# EAGLE schematic Nava_v1.02 (EAGLE 6.1), part 1 of 2

## Sheet 1 of 15: SEQ
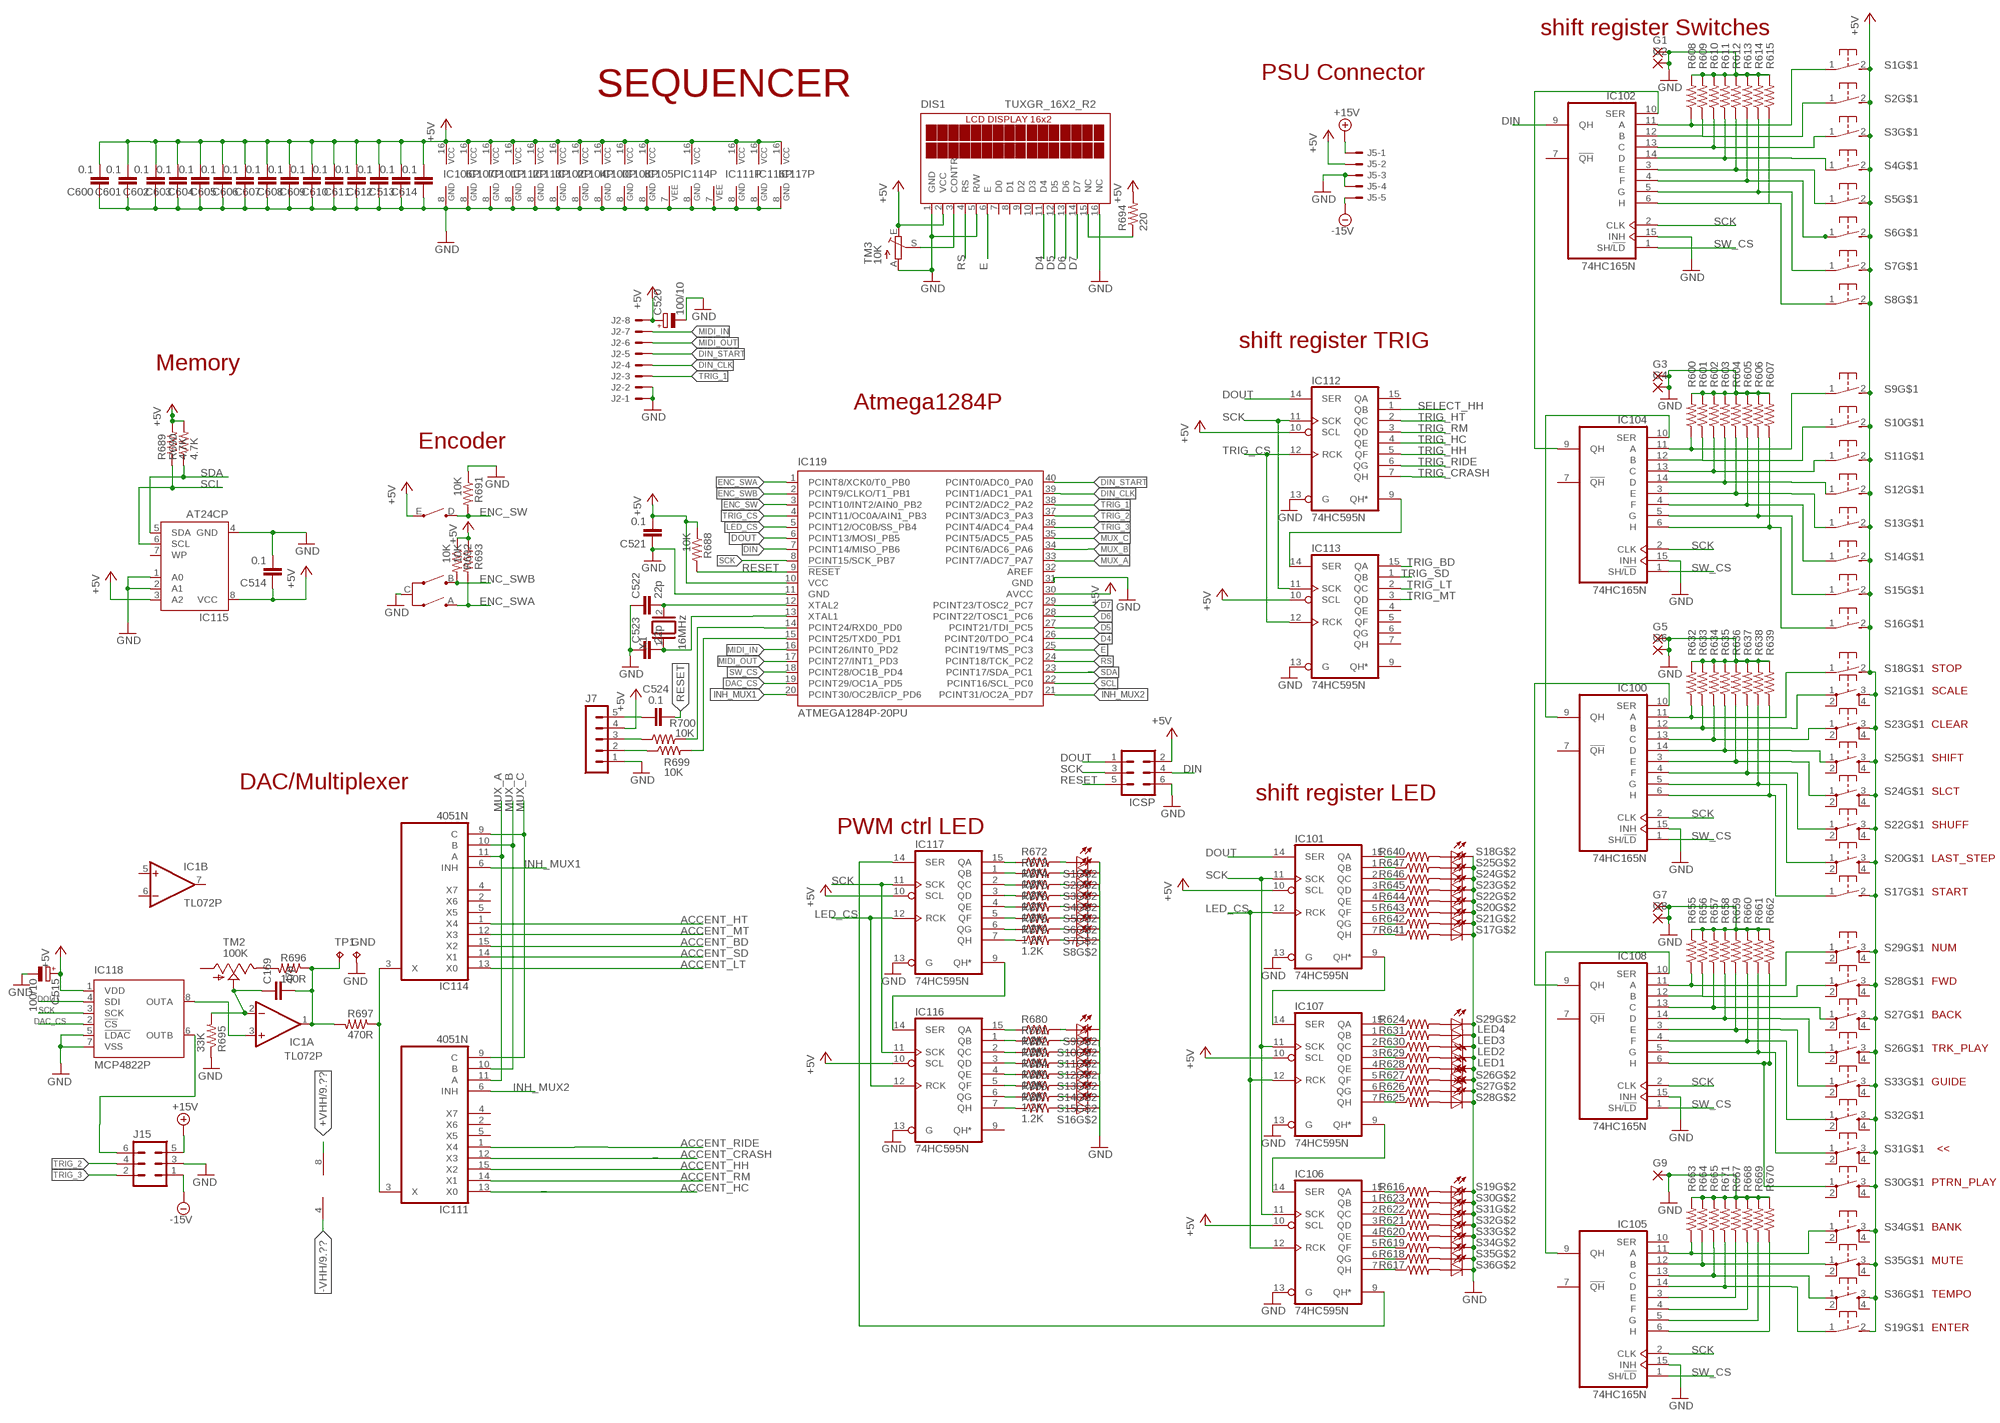
[diagram p0: schematic, sheet 1]

### Parts
C169  47p  C-EU025-025X050  [C025-025X050]
C513  0.1  C-EU050-024X044  [C050-024X044]
C514  0.1  C-EU050-024X044  [C050-024X044]
C515  100/10  CPOL-EUE2-5  [E2-5]
C520  100/10  CPOL-EUE2-5  [E2-5]
C521  0.1  C-EU050-024X044  [C050-024X044]
C522  22p  C-EU025-025X050  [C025-025X050]
C523  22p  C-EU025-025X050  [C025-025X050]
C524  0.1  C-EU050-024X044  [C050-024X044]
C600  0.1  C-EU050-024X044  [C050-024X044]
C601  0.1  C-EU050-024X044  [C050-024X044]
C602  0.1  C-EU050-024X044  [C050-024X044]
C603  0.1  C-EU050-024X044  [C050-024X044]
C604  0.1  C-EU050-024X044  [C050-024X044]
C605  0.1  C-EU050-024X044  [C050-024X044]
C606  0.1  C-EU050-024X044  [C050-024X044]
C607  0.1  C-EU050-024X044  [C050-024X044]
C608  0.1  C-EU050-024X044  [C050-024X044]
C609  0.1  C-EU050-024X044  [C050-024X044]
C610  0.1  C-EU050-024X044  [C050-024X044]
C611  0.1  C-EU050-024X044  [C050-024X044]
C612  0.1  C-EU050-024X044  [C050-024X044]
C614  0.1  C-EU050-024X044  [C050-024X044]
DIS1  TUXGR_16X2_R2  [TUXGR_16X2_R2]
G1  WIREPAD1,6/0,8  [1,6/0,8]
G2  WIREPAD1,6/0,8  [1,6/0,8]
G3  WIREPAD1,6/0,8  [1,6/0,8]
G4  WIREPAD1,6/0,8  [1,6/0,8]
G5  WIREPAD1,6/0,8  [1,6/0,8]
G6  WIREPAD1,6/0,8  [1,6/0,8]
G7  WIREPAD1,6/0,8  [1,6/0,8]
G8  WIREPAD1,6/0,8  [1,6/0,8]
G9  WIREPAD1,6/0,8  [1,6/0,8]
GND  TPPAD1-13  [P1-13]
IC1  TL072P  [DIL08]
IC100  74HC165N  [DIL16]
IC101  74HC595N  [DIL16]
IC102  74HC165N  [DIL16]
IC104  74HC165N  [DIL16]
IC105  74HC165N  [DIL16]
IC106  74HC595N  [DIL16]
IC107  74HC595N  [DIL16]
IC108  74HC165N  [DIL16]
IC111  4051N  [DIL16]
IC112  74HC595N  [DIL16]
IC113  74HC595N  [DIL16]
IC114  4051N  [DIL16]
IC115  AT24CP  [DIL08]
IC116  74HC595N  [DIL16]
IC117  74HC595N  [DIL16]
IC118  MCP4822P  [DIL8]
IC119  ATMEGA1284P-20PU  ATMEGA644-20PUDIP  [DIL40]
ICSP  MA03-2  [MA03-2]
J2  22-27-2081-08  [6410-08]
J5  KK-156-5  [KK-156-5]
J7  MA05-1  [MA05-1A]
J15  MA03-2  [MA03-2]
LED1  LED3MM  [LED3MM]
LED2  LED3MM  [LED3MM]
LED3  LED3MM  [LED3MM]
LED4  LED3MM  [LED3MM]
R600  10K  R-US_0207/7  [0207/7]
R601  10K  R-US_0207/7  [0207/7]
R602  10K  R-US_0207/7  [0207/7]
R603  10K  R-US_0207/7  [0207/7]
R604  10K  R-US_0207/7  [0207/7]
R605  10K  R-US_0207/7  [0207/7]
R606  10K  R-US_0207/7  [0207/7]
R607  10K  R-US_0207/7  [0207/7]
R608  10K  R-US_0207/7  [0207/7]
R609  10K  R-US_0207/7  [0207/7]
R610  10K  R-US_0207/7  [0207/7]
R611  10K  R-US_0207/7  [0207/7]
R612  10K  R-US_0207/7  [0207/7]
R613  10K  R-US_0207/7  [0207/7]
R614  10K  R-US_0207/7  [0207/7]
R615  10K  R-US_0207/7  [0207/7]
R616  1.2K  R-US_0207/7  [0207/7]
R617  1.2K  R-US_0207/7  [0207/7]
R618  1.2K  R-US_0207/7  [0207/7]
R619  1.2K  R-US_0207/7  [0207/7]
R620  1.2K  R-US_0207/7  [0207/7]
R621  1.2K  R-US_0207/7  [0207/7]
R622  1.2K  R-US_0207/7  [0207/7]
R623  1.2K  R-US_0207/7  [0207/7]
R624  1.2K  R-US_0207/7  [0207/7]
R625  1.2K  R-US_0207/7  [0207/7]
R626  1.2K  R-US_0207/7  [0207/7]
R627  1.2K  R-US_0207/7  [0207/7]
R628  1.2K  R-US_0207/7  [0207/7]
R629  1.2K  R-US_0207/7  [0207/7]
R630  1.2K  R-US_0207/7  [0207/7]
R631  1.2K  R-US_0207/7  [0207/7]
R632  10K  R-US_0207/7  [0207/7]
R633  10K  R-US_0207/7  [0207/7]
R634  10K  R-US_0207/7  [0207/7]
R635  10K  R-US_0207/7  [0207/7]
R636  10K  R-US_0207/7  [0207/7]
R637  10K  R-US_0207/7  [0207/7]
R638  10K  R-US_0207/7  [0207/7]
R639  10K  R-US_0207/7  [0207/7]
R640  1.2K  R-US_0207/7  [0207/7]
R641  1.2K  R-US_0207/7  [0207/7]
R642  1.2K  R-US_0207/7  [0207/7]
R643  1.2K  R-US_0207/7  [0207/7]
R644  1.2K  R-US_0207/7  [0207/7]
R645  1.2K  R-US_0207/7  [0207/7]
R646  1.2K  R-US_0207/7  [0207/7]
R647  1.2K  R-US_0207/7  [0207/7]
R655  10K  R-US_0207/7  [0207/7]
R656  10K  R-US_0207/7  [0207/7]
R657  10K  R-US_0207/7  [0207/7]
R658  10K  R-US_0207/7  [0207/7]
R659  10K  R-US_0207/7  [0207/7]
R660  10K  R-US_0207/7  [0207/7]
R661  10K  R-US_0207/7  [0207/7]
R662  10K  R-US_0207/7  [0207/7]
R663  10K  R-US_0207/7  [0207/7]
R664  10K  R-US_0207/7  [0207/7]
R665  10K  R-US_0207/7  [0207/7]
R667  10K  R-US_0207/7  [0207/7]
R668  10K  R-US_0207/7  [0207/7]
R669  10K  R-US_0207/7  [0207/7]
R670  10K  R-US_0207/7  [0207/7]
R671  10K  R-US_0207/7  [0207/7]
R672  1.2K  R-US_0207/7  [0207/7]
R673  1.2K  R-US_0207/7  [0207/7]
R674  1.2K  R-US_0207/7  [0207/7]
R675  1.2K  R-US_0207/7  [0207/7]
R676  1.2K  R-US_0207/7  [0207/7]
R677  1.2K  R-US_0207/7  [0207/7]
R678  1.2K  R-US_0207/7  [0207/7]
R679  1.2K  R-US_0207/7  [0207/7]
R680  1.2K  R-US_0207/7  [0207/7]
R681  1.2K  R-US_0207/7  [0207/7]
R682  1.2K  R-US_0207/7  [0207/7]
R683  1.2K  R-US_0207/7  [0207/7]
R684  1.2K  R-US_0207/7  [0207/7]
R685  1.2K  R-US_0207/7  [0207/7]
R686  1.2K  R-US_0207/7  [0207/7]
R687  1.2K  R-US_0207/7  [0207/7]
R688  10K  R-US_0207/7  [0207/7]
R689  4.7K  R-US_0207/7  [0207/7]
R690  4.7K  R-US_0207/7  [0207/7]
R691  10K  R-US_0207/7  [0207/7]
R692  10K  R-US_0207/7  [0207/7]
R693  10K  R-US_0207/7  [0207/7]
R694  220  R-US_0207/7  [0207/7]
R695  33K  R-US_0207/7  [0207/7]
R696  100R  R-US_0207/7  [0207/7]
R697  470R  R-US_0207/7  [0207/7]
R699  10K  R-US_0207/7  [0207/7]
R700  10K  R-US_0207/7  [0207/7]
S1  MX1A_CHERRY_SW_LED"  [MX1A-SW]
S2  MX1A_CHERRY_SW_LED"  [MX1A-SW]
S3  MX1A_CHERRY_SW_LED"  [MX1A-SW]
S4  MX1A_CHERRY_SW_LED"  [MX1A-SW]
S5  MX1A_CHERRY_SW_LED"  [MX1A-SW]
S6  MX1A_CHERRY_SW_LED"  [MX1A-SW]
S7  MX1A_CHERRY_SW_LED"  [MX1A-SW]
S8  MX1A_CHERRY_SW_LED"  [MX1A-SW]
S9  MX1A_CHERRY_SW_LED"  [MX1A-SW]
S10  MX1A_CHERRY_SW_LED"  [MX1A-SW]
S11  MX1A_CHERRY_SW_LED"  [MX1A-SW]
S12  MX1A_CHERRY_SW_LED"  [MX1A-SW]
S13  MX1A_CHERRY_SW_LED"  [MX1A-SW]
S14  MX1A_CHERRY_SW_LED"  [MX1A-SW]
S15  MX1A_CHERRY_SW_LED"  [MX1A-SW]
S16  MX1A_CHERRY_SW_LED"  [MX1A-SW]
S17  MX1A_CHERRY_SW_LED"  [MX1A-SW]
S18  MX1A_CHERRY_SW_LED"  [MX1A-SW]
S19  MX1A_CHERRY_SW_LED"  [MX1A-SW]
S20  ZTSN_SW_LED"  [SPH_SW]
S21  ZTSN_SW_LED"  [SPH_SW]
S22  ZTSN_SW_LED"  [SPH_SW]
S23  ZTSN_SW_LED"  [SPH_SW]
S24  ZTSN_SW_LED"  [SPH_SW]
S25  ZTSN_SW_LED"  [SPH_SW]
S26  ZTSN_SW_LED"  [SPH_SW]
S27  ZTSN_SW_LED"  [SPH_SW]
S28  ZTSN_SW_LED"  [SPH_SW]
S29  ZTSN_SW_LED"  [SPH_SW]
S30  ZTSN_SW_LED"  [SPH_SW]
S31  ZTSN_SW_LED"  [SPH_SW]
S32  ZTSN_SW_LED"  [SPH_SW]
S33  ZTSN_SW_LED"  [SPH_SW]
S34  ZTSN_SW_LED"  [SPH_SW]
S35  ZTSN_SW_LED"  [SPH_SW]
S36  ZTSN_SW_LED"  [SPH_SW]
TM2  100K  TRIM_US-S64W  [S64W]
TM3  10K  TRIM_EU-B25P  [B25P]
TP1  TPPAD1-13  [P1-13]
VR29  PEC16_ENCODER  [PEC16_ENCODER]
X1  16MHz  XTAL/S  [QS]

### Nets
+5V: C513.2 C514.1 C515.+ C520.+ C521.2 C600.2 C601.2 C602.2 C603.2 C604.2 C605.2 C606.2 C607.2 C608.2 C609.2 C610.2 C611.2 C612.2 C614.2 DIS1.2(VCC) IC100.16(VCC) IC101.10(SCL) IC101.16(VCC) IC102.16(VCC) IC104.16(VCC) IC105.16(VCC) IC106.10(SCL) IC106.16(VCC) IC107.10(SCL) IC107.16(VCC) IC108.16(VCC) IC111.16(VCC) IC112.10(SCL) IC112.16(VCC) IC113.10(SCL) IC113.16(VCC) IC114.16(VCC) IC115.3(A2) IC115.8(VCC) IC116.10(SCL) IC116.16(VCC) IC117.10(SCL) IC117.16(VCC) IC118.1(VDD) IC119.10(VCC) IC119.30(AVCC) ICSP.2 J2.8 J5.2 J7.4 R688.1 R689.2 R690.2 R692.1 R693.1 R694.2 S1.2(S) S2.2(S) S3.2(S) S4.2(S) S5.2(S) S6.2(S) S7.2(S) S8.2(S) S9.2(S) S10.2(S) S11.2(S) S12.2(S) S13.2(S) S14.2(S) S15.2(S) S16.2(S) S17.2(S) S18.2(S) S19.2(S) S20.3(S) S22.3(S) S23.3(S) S24.3(S) S25.3(S) S26.3(S) S27.3(S) S28.3(S) S29.3(S) S30.3(S) S31.3(S) S32.3(S) S33.3(S) S34.3(S) S35.3(S) S36.3(S) TM3.E VR29.E ; also sheet 9,10,11,14,15
+15V: J5.1 J15.5 ; also sheet 2,3,4,6,7,8,9,11,12,13
+VHH: IC1.8(P:V+) ; also sheet 9
-15V: J5.5 J15.1 ; also sheet 2,3,4,6,7,8,9,11,12,13
-VHH: IC1.4(P:V-) ; also sheet 9
ACCENT_BD: IC114.15(X2) ; also sheet 2
ACCENT_CRASH: IC111.12(X3) ; also sheet 10
ACCENT_HC: IC111.13(X0) ; also sheet 8
ACCENT_HH: IC111.15(X2) ; also sheet 9
ACCENT_HT: IC114.1(X4) ; also sheet 6
ACCENT_LT: IC114.13(X0) ; also sheet 4
ACCENT_MT: IC114.12(X3) ; also sheet 5
ACCENT_RIDE: IC111.1(X4) ; also sheet 11
ACCENT_RM: IC111.14(X1) ; also sheet 7
ACCENT_SD: IC114.14(X1) ; also sheet 3
D4 [special]: DIS1.11(D4) IC119.26(PCINT20/TDO_PC4)
D5 [special]: DIS1.12(D5) IC119.27(PCINT21/TDI_PC5)
D6 [special]: DIS1.13(D6) IC119.28(PCINT22/TOSC1_PC6)
D7 [special]: DIS1.14(D7) IC119.29(PCINT23/TOSC2_PC7)
DAC_CS [special]: IC118.2(!CS!) IC119.19(PCINT29/OC1A_PD5)
DIN [special]: IC102.9(QH) IC119.7(PCINT14/MISO_PB6) ICSP.4
DIN_CLK [special]: IC119.39(PCINT1/ADC1_PA1) J2.4
DIN_START [special]: IC119.40(PCINT0/ADC0_PA0) J2.5
DOUT [special]: IC101.14(SER) IC112.14(SER) IC118.4(SDI) IC119.6(PCINT13/MOSI_PB5) ICSP.1
E [special]: DIS1.6(E) IC119.25(PCINT19/TMS_PC3)
ENC_SW [special]: IC119.3(PCINT10/INT2/AIN0_PB2) R691.2 VR29.D
ENC_SWA [special]: IC119.1(PCINT8/XCK0/T0_PB0) R693.2 VR29.A
ENC_SWB [special]: IC119.2(PCINT9/CLKO/T1_PB1) R692.2 VR29.B
GND: C513.1 C514.2 C515.- C520.- C521.1 C522.1 C523.1 C600.1 C601.1 C602.1 C603.1 C604.1 C605.1 C606.1 C607.1 C608.1 C609.1 C610.1 C611.1 C612.1 C614.1 DIS1.1(GND) DIS1.5(R/W) DIS1.16(NC) G1.1(P) G2.1(P) G3.1(P) G4.1(P) G5.1(P) G6.1(P) G7.1(P) G8.1(P) G9.1(P) GND.TP IC100.8(GND) IC100.15(INH) IC101.8(GND) IC101.13(G) IC102.8(GND) IC102.15(INH) IC104.8(GND) IC104.15(INH) IC105.8(GND) IC105.15(INH) IC106.8(GND) IC106.13(G) IC107.8(GND) IC107.13(G) IC108.8(GND) IC108.15(INH) IC111.7(VEE) IC111.8(GND) IC112.8(GND) IC112.13(G) IC113.8(GND) IC113.13(G) IC114.7(VEE) IC114.8(GND) IC115.1(A0) IC115.2(A1) IC115.4(GND) IC116.8(GND) IC116.13(G) IC117.8(GND) IC117.13(G) IC118.5(!LDAC!) IC118.7(VSS) IC119.11(GND) IC119.31(GND) ICSP.6 J2.1 J2.2 J5.3 J5.4 J7.1 J15.3 LED1.K(C) LED2.K(C) LED3.K(C) LED4.K(C) R600.2 R601.2 R602.2 R603.2 R604.2 R605.2 R606.2 R607.2 R608.2 R609.2 R610.2 R611.2 R612.2 R613.2 R614.2 R615.2 R632.2 R633.2 R634.2 R635.2 R636.2 R637.2 R638.2 R639.2 R655.2 R656.2 R657.2 R658.2 R659.2 R660.2 R661.2 R662.2 R663.2 R664.2 R665.2 R667.2 R668.2 R669.2 R670.2 R671.2 R691.1 R695.1 S1.K(C) S2.K(C) S3.K(C) S4.K(C) S5.K(C) S6.K(C) S7.K(C) S8.K(C) S9.K(C) S10.K(C) S11.K(C) S12.K(C) S13.K(C) S14.K(C) S15.K(C) S16.K(C) S17.K(C) S18.K(C) S19.K(C) S20.K(C) S21.K(C) S22.K(C) S23.K(C) S24.K(C) S25.K(C) S26.K(C) S27.K(C) S28.K(C) S29.K(C) S30.K(C) S31.K(C) S32.K(C) S33.K(C) S34.K(C) S35.K(C) S36.K(C) TM3.A VR29.C ; also sheet 2,3,4,5,6,7,8,9,10,11,12,13,14,15
INH_MUX1 [special]: IC114.6(INH) IC119.20(PCINT30/OC2B/ICP_PD6)
INH_MUX2 [special]: IC111.6(INH) IC119.21(PCINT31/OC2A_PD7)
LED_CS [special]: IC101.12(RCK) IC106.12(RCK) IC107.12(RCK) IC116.12(RCK) IC117.12(RCK) IC119.5(PCINT12/OC0B/SS_PB4)
MIDI_IN [special]: IC119.16(PCINT26/INT0_PD2) J2.7
MIDI_OUT [special]: IC119.17(PCINT27/INT1_PD3) J2.6
MUX_A [special]: IC111.11(A) IC114.11(A) IC119.33(PCINT7/ADC7_PA7)
MUX_B [special]: IC111.10(B) IC114.10(B) IC119.34(PCINT6/ADC6_PA6)
MUX_C [special]: IC111.9(C) IC114.9(C) IC119.35(PCINT5/ADC5_PA5)
N$1 [special]: R624.2 S29.A
N$2 [special]: R625.2 S28.A
N$3 [special]: R626.2 S27.A
N$4 [special]: R627.2 S26.A
N$5 [special]: R647.2 S25.A
N$6 [special]: R646.2 S24.A
N$7 [special]: R645.2 S23.A
N$8 [special]: R644.2 S22.A
N$9 [special]: R642.2 S21.A
N$10 [special]: R643.2 S20.A
N$11 [special]: R640.2 S18.A
N$12 [special]: R641.2 S17.A
N$13 [special]: LED4.A R631.2
N$14 [special]: LED3.A R630.2
N$15 [special]: LED2.A R629.2
N$16 [special]: LED1.A R628.2
N$17 [special]: R616.2 S19.A
N$18 [special]: R617.2 S36.A
N$19 [special]: R618.2 S35.A
N$20 [special]: R619.2 S34.A
N$21 [special]: R620.2 S33.A
N$22 [special]: R621.2 S32.A
N$23 [special]: R622.2 S31.A
N$24 [special]: R623.2 S30.A
N$163 [special]: IC108.14(D) R658.1 S26.1(P)
N$164: IC1.3(A:+IN) IC118.8(OUTA)
N$166 [special]: IC117.15(QA) R672.1
N$222 [special]: IC117.1(QB) R673.1
N$231 [special]: IC117.2(QC) R674.1
N$233 [special]: IC117.3(QD) R675.1
N$236 [special]: IC117.4(QE) R676.1
N$237 [special]: IC117.5(QF) R677.1
N$238 [special]: IC117.6(QG) R678.1
N$239 [special]: IC117.7(QH) R679.1
N$241 [special]: IC116.14(SER) IC117.9(QH*)
N$242 [special]: IC116.15(QA) R680.1
N$243 [special]: IC116.1(QB) R681.1
N$244 [special]: IC116.2(QC) R682.1
N$245 [special]: IC116.3(QD) R683.1
N$246 [special]: IC116.4(QE) R684.1
N$247 [special]: IC116.5(QF) R685.1
N$248 [special]: IC116.6(QG) R686.1
N$249 [special]: IC116.7(QH) R687.1
N$250 [special]: R680.2 S9.A
N$251 [special]: R681.2 S10.A
N$252 [special]: R682.2 S11.A
N$253 [special]: R683.2 S12.A
N$254 [special]: R684.2 S13.A
N$255 [special]: R685.2 S14.A
N$256 [special]: R686.2 S15.A
N$257 [special]: R687.2 S16.A
N$258 [special]: R672.2 S1.A
N$259 [special]: R673.2 S2.A
N$260 [special]: R674.2 S3.A
N$261 [special]: R675.2 S4.A
N$262 [special]: R676.2 S5.A
N$263 [special]: R677.2 S6.A
N$264 [special]: R678.2 S7.A
N$265 [special]: R679.2 S8.A
N$266 [special]: IC106.9(QH*) IC117.14(SER)
N$268 [special]: IC118.6(OUTB) J15.6
N$272 [special]: IC119.15(PCINT25/TXD0_PD1) R699.2
N$273 [special]: IC119.14(PCINT24/RXD0_PD0) R700.2
N$377 [special]: C522.2 IC119.12(XTAL2) X1.2
N$378 [special]: C523.2 IC119.13(XTAL1) X1.1
N$587 [special]: IC102.11(A) R608.1 S1.1(P)
N$592 [special]: IC102.12(B) R609.1 S2.1(P)
N$593 [special]: IC102.13(C) R610.1 S3.1(P)
N$594 [special]: IC102.14(D) R611.1 S4.1(P)
N$595 [special]: IC102.3(E) R612.1 S5.1(P)
N$596 [special]: IC102.4(F) R613.1 S6.1(P)
N$597 [special]: IC102.5(G) R614.1 S7.1(P)
N$598 [special]: IC102.6(H) R615.1 S8.1(P)
N$599 [special]: IC104.11(A) R600.1 S9.1(P)
N$600 [special]: IC104.12(B) R601.1 S10.1(P)
N$601 [special]: IC104.13(C) R602.1 S11.1(P)
N$602 [special]: IC104.14(D) R603.1 S12.1(P)
N$603 [special]: IC104.3(E) R604.1 S13.1(P)
N$604 [special]: IC104.4(F) R605.1 S14.1(P)
N$605 [special]: IC104.5(G) R606.1 S15.1(P)
N$606 [special]: IC104.6(H) R607.1 S16.1(P)
N$607 [special]: IC100.11(A) R632.1 S18.1(P)
N$608 [special]: IC100.12(B) R633.1 S21.1(P)
N$609 [special]: IC100.13(C) R634.1 S23.1(P)
N$610 [special]: IC100.14(D) R635.1 S25.1(P)
N$611 [special]: IC100.3(E) R636.1 S24.1(P)
N$612 [special]: IC100.4(F) R637.1 S22.1(P)
N$613 [special]: IC100.5(G) R638.1 S20.1(P)
N$614 [special]: IC102.10(SER) IC104.9(QH)
N$615 [special]: IC100.9(QH) IC104.10(SER)
N$633 [special]: IC100.6(H) R639.1 S17.1(P)
N$634 [special]: IC111.3(X) IC114.3(X) R697.1
N$639 [special]: IC101.15(QA) R640.1
N$640 [special]: IC100.10(SER) IC108.9(QH)
N$641 [special]: IC108.11(A) R655.1 S29.1(P)
N$642 [special]: IC108.12(B) R656.1 S28.1(P)
N$643 [special]: IC108.13(C) R657.1 S27.1(P)
N$645 [special]: IC108.3(E) R659.1 S33.1(P)
N$646 [special]: IC108.4(F) R660.1 S32.1(P)
N$647 [special]: IC108.5(G) R661.1 S31.1(P)
N$648 [special]: IC108.6(H) R662.1 S30.1(P)
N$649 [special]: IC101.1(QB) R647.1
N$650 [special]: IC105.9(QH) IC108.10(SER)
N$651 [special]: IC101.2(QC) R646.1
N$652 [special]: IC105.11(A) R663.1 S34.1(P)
N$653 [special]: IC105.12(B) R664.1 S35.1(P)
N$654 [special]: IC105.13(C) R665.1 S36.1(P)
N$655 [special]: IC105.14(D) R671.1 S19.1(P)
N$656 [special]: IC105.3(E) R667.1
N$657 [special]: IC105.4(F) R668.1
N$658 [special]: IC105.5(G) R669.1
N$659 [special]: IC105.6(H) R670.1
N$660 [special]: IC101.3(QD) R645.1
N$661 [special]: IC101.4(QE) R644.1
N$662 [special]: IC101.5(QF) R643.1
N$663 [special]: IC101.6(QG) R642.1
N$664 [special]: IC101.7(QH) R641.1
N$665 [special]: IC107.15(QA) R624.1
N$666 [special]: IC107.1(QB) R631.1
N$667 [special]: IC107.2(QC) R630.1
N$668 [special]: IC107.3(QD) R629.1
N$669 [special]: IC107.4(QE) R628.1
N$670 [special]: IC107.5(QF) R627.1
N$671 [special]: IC107.6(QG) R626.1
N$672 [special]: IC107.7(QH) R625.1
N$673 [special]: IC101.9(QH*) IC107.14(SER)
N$674 [special]: IC106.14(SER) IC107.9(QH*)
N$675 [special]: IC106.15(QA) R616.1
N$676 [special]: IC106.1(QB) R623.1
N$677 [special]: IC106.2(QC) R622.1
N$678 [special]: IC106.3(QD) R621.1
N$679 [special]: IC106.4(QE) R620.1
N$680 [special]: IC106.5(QF) R619.1
N$681 [special]: IC106.6(QG) R618.1
N$682 [special]: IC106.7(QH) R617.1
N$707: R696.2 TM2.E
N$708: C169.2 IC1.1(A:OUT) R696.1 R697.2 TP1.TP
N$709: C169.1 IC1.2(A:-IN) R695.2 TM2.S
N$722 [special]: DIS1.15(NC) R694.1
N$723 [special]: DIS1.3(CONTR) TM3.S
N$725 [special]: IC112.9(QH*) IC113.14(SER)
N$771 [special]: C524.2 J7.5
N$786 [special]: J7.3 R700.1
N$787 [special]: J7.2 R699.1
RESET [special]: C524.1 IC119.9(!RESET) ICSP.5 R688.2
RS [special]: DIS1.4(RS) IC119.24(PCINT18/TCK_PC2)
SCK [special]: IC100.2(CLK) IC101.11(SCK) IC102.2(CLK) IC104.2(CLK) IC105.2(CLK) IC106.11(SCK) IC107.11(SCK) IC108.2(CLK) IC112.11(SCK) IC113.11(SCK) IC116.11(SCK) IC117.11(SCK) IC118.3(SCK) IC119.8(PCINT15/SCK_PB7) ICSP.3
SCL [special]: IC115.6(SCL) IC119.22(PCINT16/SCL_PC0) R689.1
SDA [special]: IC115.5(SDA) IC119.23(PCINT17/SDA_PC1) R690.1
SELECT_HH: IC112.1(QB) ; also sheet 9
SW_CS [special]: IC100.1(SH/!LD) IC102.1(SH/!LD) IC104.1(SH/!LD) IC105.1(SH/!LD) IC108.1(SH/!LD) IC119.18(PCINT28/OC1B_PD4)
TRIG_1 [special]: IC119.38(PCINT2/ADC2_PA2) J2.3
TRIG_2 [special]: IC119.37(PCINT3/ADC3_PA3) J15.4
TRIG_3 [special]: IC119.36(PCINT4/ADC4_PA4) J15.2
TRIG_BD: IC113.15(QA) ; also sheet 2
TRIG_CRASH: IC112.7(QH) ; also sheet 10
TRIG_CS [special]: IC112.12(RCK) IC113.12(RCK) IC119.4(PCINT11/OC0A/AIN1_PB3)
TRIG_HC: IC112.4(QE) ; also sheet 8
TRIG_HH: IC112.5(QF) ; also sheet 9
TRIG_HT: IC112.2(QC) ; also sheet 6,12
TRIG_LT: IC113.2(QC) ; also sheet 4,12
TRIG_MT: IC113.3(QD) ; also sheet 5,12
TRIG_RIDE: IC112.6(QG) ; also sheet 11
TRIG_RM: IC112.3(QD) ; also sheet 7
TRIG_SD: IC113.1(QB) ; also sheet 3
Unconnected: DIS1.7(D0) DIS1.8(D1) DIS1.9(D2) DIS1.10(D3) IC1.5(B:+IN) IC1.6(B:-IN) IC1.7(B:OUT) IC100.7(!QH) IC102.7(!QH) IC104.7(!QH) IC105.7(!QH) IC105.10(SER) IC108.7(!QH) IC111.2(X6) IC111.4(X7) IC111.5(X5) IC112.15(QA) IC113.4(QE) IC113.5(QF) IC113.6(QG) IC113.7(QH) IC113.9(QH*) IC114.2(X6) IC114.4(X7) IC114.5(X5) IC115.7(WP) IC116.9(QH*) IC119.32(AREF) S20.2(P1) S20.4(S1) S21.2(P1) S21.3(S) S21.4(S1) S22.2(P1) S22.4(S1) S23.2(P1) S23.4(S1) S24.2(P1) S24.4(S1) S25.2(P1) S25.4(S1) S26.2(P1) S26.4(S1) S27.2(P1) S27.4(S1) S28.2(P1) S28.4(S1) S29.2(P1) S29.4(S1) S30.2(P1) S30.4(S1) S31.2(P1) S31.4(S1) S32.2(P1) S32.4(S1) S33.2(P1) S33.4(S1) S34.2(P1) S34.4(S1) S35.2(P1) S35.4(S1) S36.2(P1) S36.4(S1) TM2.A

### Notes on the sheet
- shift register Switches
- PSU Connector
- SEQUENCER
- shift register TRIG
- Memory
- Atmega1284P
- Encoder
- STOP
- SCALE
- CLEAR
- SHIFT
- DAC/Multiplexer
- SLCT
- shift register LED
- SHUFF
- PWM ctrl LED
- LAST_STEP
- START
- NUM
- FWD
- BACK
- TRK_PLAY
- GUIDE
- <<
- PTRN_PLAY
- BANK
- MUTE
- TEMPO
- ENTER

## Sheet 2 of 15: BD
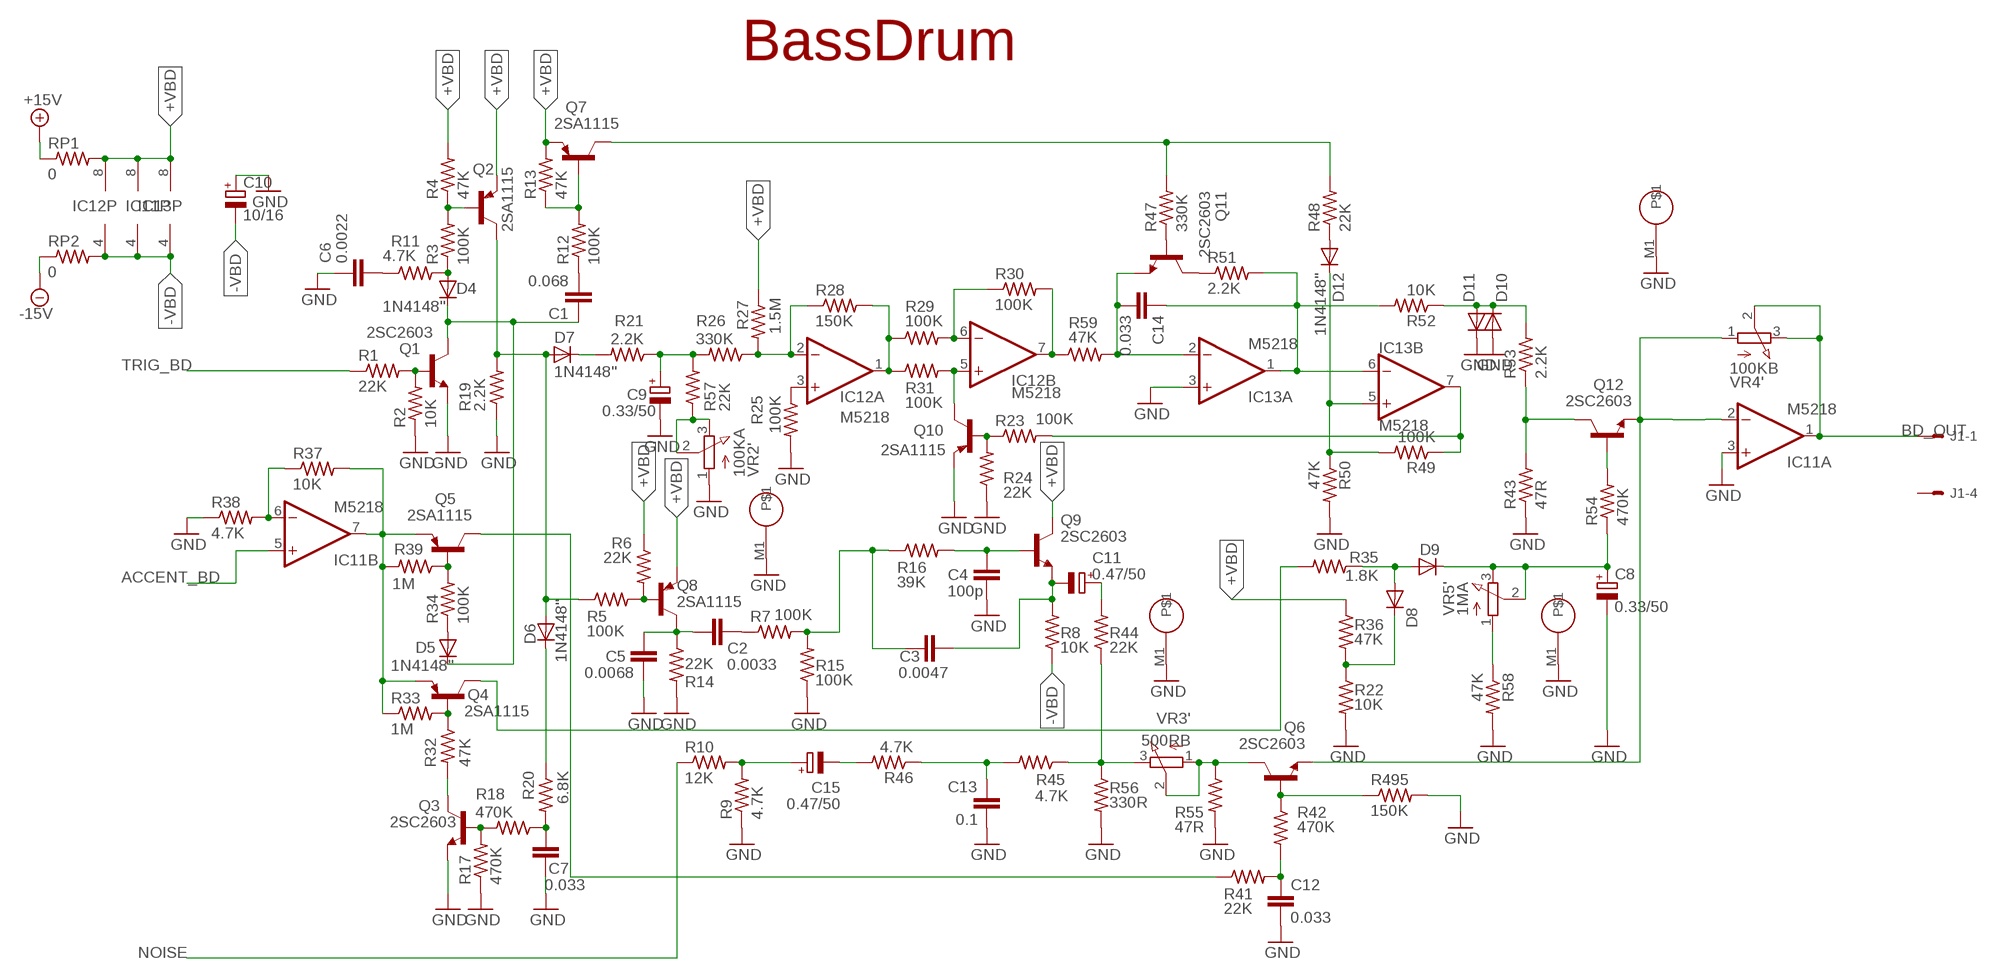
[diagram p1: schematic, sheet 2]

### Parts
C1  0.068  C-EU050-025X075  [C050-025X075]
C2  0.0033  C-EU050-025X075  [C050-025X075]
C3  0.0047  C-EU050-025X075  [C050-025X075]
C4  100p  C-EU050-025X075  [C050-025X075]
C5  0.0068  C-EU050-025X075  [C050-025X075]
C6  0.0022  C-EU050-025X075  [C050-025X075]
C7  0.033  C-EU050-025X075  [C050-025X075]
C8  0.33/50  CPOL-EUE2-5  [E2-5]
C9  0.33/50  CPOL-EUE2-5  [E2-5]
C10  10/16  CPOL-EUE2-5  [E2-5]
C11  0.47/50  CPOL-EUE2-5  [E2-5]
C12  0.033  C-EU050-025X075  [C050-025X075]
C13  0.1  C-EU050-025X075  [C050-025X075]
C14  0.033  C-EU050-025X075  [C050-025X075]
C15  0.47/50  CPOL-EUE2-5  [E2-5]
D4  1N4148"  [DO35-7C]
D5  1N4148"  [DO35-7C]
D6  1N4148"  [DO35-7C]
D7  1N4148"  [DO35-7C]
D8  1N4148"  [DO35-7C]
D9  1N4148"  [DO35-7C]
D10  1N4148"  [DO35-7C]
D11  1N4148"  [DO35-7C]
D12  1N4148"  [DO35-7C]
IC11  M5218  [SIL8]
IC12  M5218  [SIL8]
IC13  M5218  [SIL8]
J1  22-27-2041-04  [6410-04]
Q1  2SC2603  [TO92-ECB]
Q2  2SA1115  [TO92-ECB-PNP]
Q3  2SC2603  [TO92-ECB]
Q4  2SA1115  [TO92-ECB-PNP]
Q5  2SA1115  [TO92-ECB-PNP]
Q6  2SC2603  [TO92-ECB]
Q7  2SA1115  [TO92-ECB-PNP]
Q8  2SA1115  [TO92-ECB-PNP]
Q9  2SC2603  [TO92-ECB]
Q10  2SA1115  [TO92-ECB-PNP]
Q11  2SC2603  [TO92-ECB]
Q12  2SC2603  [TO92-ECB]
R1  22K  R-US_0207/7  [0207/7]
R2  10K  R-US_0207/7  [0207/7]
R3  100K  R-US_0207/7  [0207/7]
R4  47K  R-US_0207/7  [0207/7]
R5  100K  R-US_0207/7  [0207/7]
R6  22K  R-US_0207/7  [0207/7]
R7  100K  R-US_0207/7  [0207/7]
R8  10K  R-US_0207/7  [0207/7]
R9  4.7K  R-US_0207/7  [0207/7]
R10  12K  R-US_0207/7  [0207/7]
R11  4.7K  R-US_0207/7  [0207/7]
R12  100K  R-US_0207/7  [0207/7]
R13  47K  R-US_0207/7  [0207/7]
R14  22K  R-US_0207/7  [0207/7]
R15  100K  R-US_0207/7  [0207/7]
R16  39K  R-US_0207/7  [0207/7]
R17  470K  R-US_0207/7  [0207/7]
R18  470K  R-US_0207/7  [0207/7]
R19  2.2K  R-US_0207/7  [0207/7]
R20  6.8K  R-US_0207/7  [0207/7]
R21  2.2K  R-US_0207/7  [0207/7]
R22  10K  R-US_0207/7  [0207/7]
R23  100K  R-US_0207/7  [0207/7]
R24  22K  R-US_0207/7  [0207/7]
R25  100K  R-US_0207/7  [0207/7]
R26  330K  R-US_0207/7  [0207/7]
R27  1.5M  R-US_0207/7  [0207/7]
R28  150K  R-US_0207/7  [0207/7]
R29  100K  R-US_0207/7  [0207/7]
R30  100K  R-US_0207/7  [0207/7]
R31  100K  R-US_0207/7  [0207/7]
R32  47K  R-US_0207/7  [0207/7]
R33  1M  R-US_0207/7  [0207/7]
R34  100K  R-US_0207/7  [0207/7]
R35  1.8K  R-US_0207/7  [0207/7]
R36  47K  R-US_0207/7  [0207/7]
R37  10K  R-US_0207/7  [0207/7]
R38  4.7K  R-US_0207/7  [0207/7]
R39  1M  R-US_0207/7  [0207/7]
R41  22K  R-US_0207/7  [0207/7]
R42  470K  R-US_0207/7  [0207/7]
R43  47R  R-US_0207/7  [0207/7]
R44  22K  R-US_0207/7  [0207/7]
R45  4.7K  R-US_0207/7  [0207/7]
R46  4.7K  R-US_0207/7  [0207/7]
R47  330K  R-US_0207/7  [0207/7]
R48  22K  R-US_0207/7  [0207/7]
R49  100K  R-US_0207/7  [0207/7]
R50  47K  R-US_0207/7  [0207/7]
R51  2.2K  R-US_0207/7  [0207/7]
R52  10K  R-US_0207/7  [0207/7]
R53  2.2K  R-US_0207/7  [0207/7]
R54  470K  R-US_0207/7  [0207/7]
R55  47R  R-US_0207/7  [0207/7]
R56  330R  R-US_0207/7  [0207/7]
R57  22K  R-US_0207/7  [0207/7]
R58  47K  R-US_0207/7  [0207/7]
R59  47K  R-US_0207/7  [0207/7]
R495  150K  R-US_0207/7  [0207/7]
RP1  0  R-US_0207/7  [0207/7]
RP2  0  R-US_0207/7  [0207/7]
VR2  100KA  EVUF3A  [EVUF]
VR3  500RB  EVUF3A  [EVUF]
VR4  100KB  EVUF3A  [EVUF]
VR5  1MA  EVUF3A  [EVUF]

### Nets
+15V: RP1.1 ; also sheet 1,3,4,6,7,8,9,11,12,13
+VBD [power]: IC11.8(P:V+) IC12.8(P:V+) IC13.8(P:V+) Q2.E Q7.E Q8.E Q9.C R4.2 R6.1 R13.2 R27.1 R36.1 RP1.2
-15V: RP2.1 ; also sheet 1,3,4,6,7,8,9,11,12,13
-VBD [power]: C10.- IC11.4(P:V-) IC12.4(P:V-) IC13.4(P:V-) R8.1 RP2.2
ACCENT_BD: IC11.5(B:+IN) ; also sheet 1
BD_OUT: IC11.1(A:OUT) J1.1 VR4.2(':S) VR4.3(':E)
GND: C4.2 C5.1 C6.1 C7.1 C8.- C9.- C10.+ C12.2 C13.2 D10.A D11.C IC11.3(A:+IN) IC13.3(A:+IN) Q1.E Q3.E Q10.E R2.1 R9.1 R14.2 R15.1 R17.1 R19.1 R22.2 R24.1 R25.2 R38.1 R43.1 R50.2 R55.2 R56.2 R58.2 R495.2 VR2.1(':A) VR2.M1 VR3.M1 VR4.M1 VR5.M1 ; also sheet 1,3,4,5,6,7,8,9,10,11,12,13,14,15
N$25: Q1.B R1.2 R2.2
N$26: Q2.B R3.2 R4.1
N$27: Q5.B R34.2 R39.1
N$28: Q4.B R32.1 R33.2
N$29: Q3.B R17.2 R18.2
N$30: C7.2 R18.1 R20.2
N$31: C2.2 C5.2 Q8.C R14.1
N$32: Q8.B R5.2 R6.2
N$33: D4.A R3.1 R11.2
N$34: D5.A R34.1
N$35: D6.A D7.A Q2.C R5.1 R19.2
N$36: C1.1 D4.C D5.C Q1.C
N$37: Q7.B R12.2 R13.1
N$38: Q3.C R32.2
N$39: C6.2 R11.1
N$40: C1.2 R12.1
N$41: D6.C R20.1
N$42: D7.C R21.2
N$43: C9.+ R21.1 R26.2 R57.2
N$44: R57.1 VR2.2(':S) VR2.3(':E)
N$45: IC12.2(A:-IN) R26.1 R27.2 R28.1
N$46: IC11.7(B:OUT) Q4.E Q5.E R33.1 R37.2 R39.2
N$47: IC11.6(B:-IN) R37.1 R38.2
N$48: IC12.3(A:+IN) R25.1
N$49: IC12.1(A:OUT) R28.2 R29.1 R31.1
N$50: IC12.5(B:+IN) Q10.C R31.2
N$51: IC12.6(B:-IN) R29.2 R30.1
N$52: IC12.7(B:OUT) R30.2 R59.1
N$53: Q10.B R23.1 R24.2
N$54: Q11.B R47.1
N$55: Q7.C R47.2 R48.2
N$56: C14.2 IC13.2(A:-IN) Q11.E R59.2
N$57: Q11.C R51.1
N$58: D12.A R48.1
N$59: C14.1 IC13.1(A:OUT) IC13.6(B:-IN) R51.2 R52.2
N$60: IC13.7(B:OUT) R23.2 R49.1
N$61: D12.C IC13.5(B:+IN) R49.2 R50.1
N$62: D10.C D11.A R52.1 R53.2
N$63: Q12.B R54.2
N$64: Q12.C R43.2 R53.1
N$66: C8.+ D9.C R54.1 VR5.2(':S) VR5.3(':E)
N$67: D8.C R22.1 R36.2
N$68: D8.A D9.A R35.1
N$69: R58.1 VR5.1(':A)
N$70: Q4.C R35.2
N$71: C2.1 R7.1
N$72: C3.1 R7.2 R15.2 R16.1
N$73: C4.1 Q9.B R16.2
N$74: C3.2 C11.- Q9.E R8.2
N$75: C11.+ R44.2
N$76: C15.+ R9.2 R10.2
N$77: Q6.B R42.1 R495.1
N$78: C12.1 R41.2 R42.2
N$79: C15.- R46.2
N$80: C13.1 R45.2 R46.1
N$81: R44.1 R45.1 R56.1 VR3.3(':E)
N$82: Q6.C R55.1 VR3.1(':A) VR3.2(':S)
N$83: Q5.C R41.1
N$777: IC11.2(A:-IN) Q6.E Q12.E VR4.1(':A)
NOISE [NOISE]: R10.1 ; also sheet 3,8,12
TRIG_BD: R1.1 ; also sheet 1
Unconnected: J1.4 VR2.M2 VR3.M2 VR4.M2 VR5.M2

### Notes on the sheet
- BassDrum

## Sheet 3 of 15: SD
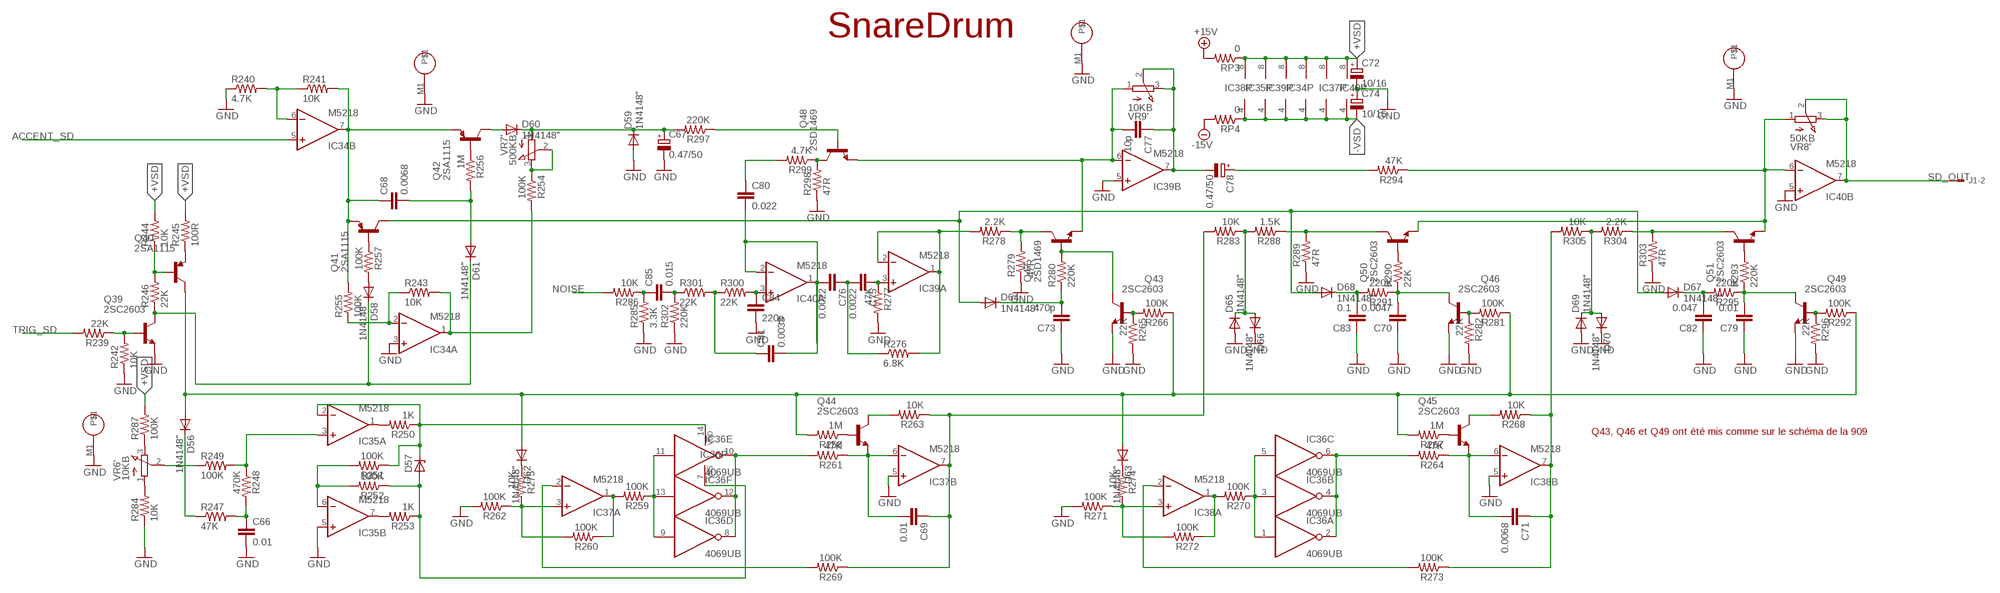
[diagram p2: schematic, sheet 3]

### Parts
C66  0.01  C-EU050-025X075  [C050-025X075]
C67  0.47/50  CPOL-EUE2-5  [E2-5]
C68  0.0068  C-EU050-025X075  [C050-025X075]
C69  0.01  C-EU050-025X075  [C050-025X075]
C70  0.0047  C-EU050-025X075  [C050-025X075]
C71  0.0068  C-EU050-025X075  [C050-025X075]
C72  10/16  CPOL-EUE2-5  [E2-5]
C73  470p  C-EU050-025X075  [C050-025X075]
C74  10/16  CPOL-EUE2-5  [E2-5]
C75  0.0022  C-EU050-025X075  [C050-025X075]
C76  0.0022  C-EU050-025X075  [C050-025X075]
C77  10p  C-EU050-025X075  [C050-025X075]
C78  0.47/50  CPOL-EUE2-5  [E2-5]
C79  0.01  C-EU050-025X075  [C050-025X075]
C80  0.022  C-EU050-025X075  [C050-025X075]
C81  0.0033  C-EU050-025X075  [C050-025X075]
C82  0.047  C-EU050-025X075  [C050-025X075]
C83  0.1  C-EU050-025X075  [C050-025X075]
C84  220p  C-EU050-025X075  [C050-025X075]
C85  0.015  C-EU050-025X075  [C050-025X075]
D56  1N4148"  [DO35-7C]
D57  ZENER-DIODE  [DO41-7]
D58  1N4148"  [DO35-7C]
D59  1N4148"  [DO35-7C]
D60  1N4148"  [DO35-7C]
D61  1N4148"  [DO35-7C]
D62  1N4148"  [DO35-7C]
D63  1N4148"  [DO35-7C]
D64  1N4148"  [DO35-7C]
D65  1N4148"  [DO35-7C]
D66  1N4148"  [DO35-7C]
D67  1N4148"  [DO35-7C]
D68  1N4148"  [DO35-7C]
D69  1N4148"  [DO35-7C]
D70  1N4148"  [DO35-7C]
IC34  M5218  [SIL8]
IC35  M5218  [SIL8]
IC36  4069UB  4069N  [DIL14]
IC37  M5218  [SIL8]
IC38  M5218  [SIL8]
IC39  M5218  [SIL8]
IC40  M5218  [SIL8]
Q39  2SC2603  [TO92-ECB]
Q40  2SA1115  [TO92-ECB-PNP]
Q41  2SA1115  [TO92-ECB-PNP]
Q42  2SA1115  [TO92-ECB-PNP]
Q43  2SC2603  [TO92-ECB]
Q44  2SC2603  [TO92-ECB]
Q45  2SC2603  [TO92-ECB]
Q46  2SC2603  [TO92-ECB]
Q47  2SD1469  [TO-3]
Q48  2SD1469  [TO-3]
Q49  2SC2603  [TO92-ECB]
Q50  2SC2603  [TO92-ECB]
Q51  2SC2603  [TO92-ECB]
R239  22K  R-US_0207/7  [0207/7]
R240  4.7K  R-US_0207/7  [0207/7]
R241  10K  R-US_0207/7  [0207/7]
R242  10K  R-US_0207/7  [0207/7]
R243  10K  R-US_0207/7  [0207/7]
R244  10K  R-US_0207/7  [0207/7]
R245  100R  R-US_0207/7  [0207/7]
R246  22K  R-US_0207/7  [0207/7]
R247  47K  R-US_0207/7  [0207/7]
R248  470K  R-US_0207/7  [0207/7]
R249  100K  R-US_0207/7  [0207/7]
R250  1K  R-US_0207/7  [0207/7]
R251  100K  R-US_0207/7  [0207/7]
R252  100K  R-US_0207/7  [0207/7]
R253  1K  R-US_0207/7  [0207/7]
R254  100K  R-US_0207/7  [0207/7]
R255  100K  R-US_0207/7  [0207/7]
R256  1M  R-US_0207/7  [0207/7]
R257  100K  R-US_0207/7  [0207/7]
R258  1M  R-US_0207/7  [0207/7]
R259  100K  R-US_0207/7  [0207/7]
R260  100K  R-US_0207/7  [0207/7]
R261  47K  R-US_0207/7  [0207/7]
R262  100K  R-US_0207/7  [0207/7]
R263  10K  R-US_0207/7  [0207/7]
R264  47K  R-US_0207/7  [0207/7]
R265  22K  R-US_0207/7  [0207/7]
R266  100K  R-US_0207/7  [0207/7]
R267  1M  R-US_0207/7  [0207/7]
R268  10K  R-US_0207/7  [0207/7]
R269  100K  R-US_0207/7  [0207/7]
R270  100K  R-US_0207/7  [0207/7]
R271  100K  R-US_0207/7  [0207/7]
R272  100K  R-US_0207/7  [0207/7]
R273  100K  R-US_0207/7  [0207/7]
R274  10K  R-US_0207/7  [0207/7]
R275  10K  R-US_0207/7  [0207/7]
R276  6.8K  R-US_0207/7  [0207/7]
R277  47K  R-US_0207/7  [0207/7]
R278  2.2K  R-US_0207/7  [0207/7]
R279  47R  R-US_0207/7  [0207/7]
R280  220K  R-US_0207/7  [0207/7]
R281  100K  R-US_0207/7  [0207/7]
R282  22K  R-US_0207/7  [0207/7]
R283  10K  R-US_0207/7  [0207/7]
R284  10K  R-US_0207/7  [0207/7]
R285  3.3K  R-US_0207/7  [0207/7]
R286  10K  R-US_0207/7  [0207/7]
R287  100K  R-US_0207/7  [0207/7]
R288  1.5K  R-US_0207/7  [0207/7]
R289  47R  R-US_0207/7  [0207/7]
R290  22K  R-US_0207/7  [0207/7]
R291  220K  R-US_0207/7  [0207/7]
R292  100K  R-US_0207/7  [0207/7]
R293  220K  R-US_0207/7  [0207/7]
R294  47K  R-US_0207/7  [0207/7]
R295  220K  R-US_0207/7  [0207/7]
R296  22K  R-US_0207/7  [0207/7]
R297  220K  R-US_0207/7  [0207/7]
R298  47R  R-US_0207/7  [0207/7]
R299  4.7K  R-US_0207/7  [0207/7]
R300  22K  R-US_0207/7  [0207/7]
R301  22K  R-US_0207/7  [0207/7]
R302  220K  R-US_0207/7  [0207/7]
R303  47R  R-US_0207/7  [0207/7]
R304  2.2K  R-US_0207/7  [0207/7]
R305  10K  R-US_0207/7  [0207/7]
RP3  0  R-US_0207/7  [0207/7]
RP4  0  R-US_0207/7  [0207/7]
VR6  10KB  EVUF3A  [EVUF]
VR7  500KB  EVUF3A  [EVUF]
VR8  50KB  EVUF3A  [EVUF]
VR9  10KB  EVUF3A  [EVUF]

### Nets
+15V: RP3.2 ; also sheet 1,2,4,6,7,8,9,11,12,13
+VSD: C72.+ IC34.8(P:V+) IC35.8(P:V+) IC37.8(P:V+) IC38.8(P:V+) IC39.8(P:V+) IC40.8(P:V+) R244.2 R245.2 R287.2 RP3.1
-15V: RP4.2 ; also sheet 1,2,4,6,7,8,9,11,12,13
-VSD [power]: C74.- IC34.4(P:V-) IC35.4(P:V-) IC37.4(P:V-) IC38.4(P:V-) IC39.4(P:V-) IC40.4(P:V-) RP4.1
ACCENT_SD: IC34.5(B:+IN) ; also sheet 1
GND: C66.2 C67.- C70.1 C72.- C73.1 C74.+ C79.1 C82.1 C83.1 C84.2 D59.A D65.A D66.C D69.A D70.C IC34.3(A:+IN) IC35.5(B:+IN) IC37.5(B:+IN) IC38.5(B:+IN) IC39.5(B:+IN) IC40.5(B:+IN) Q39.E Q43.E Q46.E Q49.E R240.1 R242.1 R262.2 R265.2 R271.2 R277.2 R279.1 R282.2 R284.1 R285.1 R289.1 R296.2 R298.1 R302.1 R303.1 VR6.M1 VR7.M1 VR8.M1 VR9.M1 ; also sheet 1,2,4,5,6,7,8,9,10,11,12,13,14,15
N$84: Q50.B R290.2
N$85: Q46.B R281.2 R282.1
N$86: C70.2 Q46.C R290.1 R291.1
N$87: Q43.C Q47.B R280.2
N$88: Q43.B R265.1 R266.2
N$89: C73.2 D64.C R280.1
N$90: C83.2 D68.C R291.2
N$91: D65.C D66.A R283.1 R288.2
N$92: Q50.C R288.1 R289.2
N$93: Q51.B R293.2
N$94: Q49.B R292.2 R296.1
N$95: C79.2 Q49.C R293.1 R295.1
N$96: C82.2 D67.C R295.2
N$97: D69.C D70.A R304.2 R305.1
N$98: Q51.C R303.2 R304.1
N$99: IC40.6(B:-IN) Q50.E Q51.E R294.1 VR8.1(':A)
N$100: Q45.B R267.1
N$101: C71.1 IC38.7(B:OUT) R268.1 R273.1 R305.2
N$102: C71.2 IC38.6(B:-IN) Q45.E R264.1
N$103: Q45.C R268.2
N$104: IC36.2(A:O) IC36.4(B:O) IC36.6(C:O) R264.2
N$105: IC36.1(A:I) IC36.3(B:I) IC36.5(C:I) R270.1
N$106: IC38.1(A:OUT) R270.2 R272.1
N$107: IC38.3(A:+IN) R271.1 R272.2 R274.2
N$108: IC38.2(A:-IN) R273.2
N$109: D63.C R274.1
N$110: Q44.B R258.1
N$111: C69.2 IC37.6(B:-IN) Q44.E R261.1
N$112: Q44.C R263.2
N$113: IC36.8(D:O) IC36.10(E:O) IC36.12(F:O) R261.2
N$114: IC36.9(D:I) IC36.11(E:I) IC36.13(F:I) R259.1
N$115: IC37.1(A:OUT) R259.2 R260.1
N$116: IC37.3(A:+IN) R260.2 R262.1 R275.2
N$117: IC37.2(A:-IN) R269.2
N$118: D62.C R275.1
N$119: D56.A D62.A D63.A Q40.C R258.2 R266.1 R267.2 R281.1 R292.1
N$120: IC35.1(A:OUT) R250.2
N$121: IC35.7(B:OUT) R253.2
N$122: IC35.6(B:-IN) R251.2 R252.2
N$123: D57.A IC36.7(P:VSS) R252.1 R253.1
N$124: D57.C IC35.2(A:-IN) IC36.14(P:VDD) R250.1 R251.1
N$125: R287.1 VR6.3(':E)
N$126: R284.2 VR6.1(':A)
N$127: R249.1 VR6.2(':S)
N$128: IC35.3(A:+IN) R248.1 R249.2
N$129: C66.1 R247.2 R248.2
N$130: D56.C R247.1
N$131: Q47.C R278.1 R279.2
N$132: C77.2 IC39.6(B:-IN) Q47.E Q48.E VR9.1(':A)
N$133: C77.1 C78.- IC39.7(B:OUT) VR9.2(':S) VR9.3(':E)
N$134: C78.+ R294.2
N$135: IC39.1(A:OUT) IC39.2(A:-IN) R276.2 R278.2
N$136: D64.A D67.A D68.A Q41.C
N$137: C75.1 IC39.3(A:+IN) R277.1
N$138: C75.2 C76.1 R276.1
N$139: C76.2 C80.2 C81.2 IC40.1(A:OUT) IC40.2(A:-IN)
N$140: C84.1 IC40.3(A:+IN) R300.2
N$141: C81.1 R300.1 R301.2
N$142: C85.2 R301.1 R302.2
N$143: C85.1 R285.2 R286.1
N$144: Q48.C R298.2 R299.1
N$145: C80.1 R299.2
N$146: C67.+ D59.C D60.C R297.2 VR7.1(':A)
N$147: R254.1 VR7.2(':S) VR7.3(':E)
N$148: D60.A Q42.C
N$149: Q42.B R256.1
N$150: Q41.B R257.1
N$151: Q48.B R297.1
N$152: D58.A R257.2
N$153: IC34.6(B:-IN) R240.2 R241.1
N$154: C68.1 IC34.7(B:OUT) Q41.E Q42.E R241.2 R255.2
N$155: IC34.2(A:-IN) R243.1 R255.1
N$156: IC34.1(A:OUT) R243.2 R254.2
N$157: C68.2 D61.A R256.2
N$158: D58.C D61.C Q39.C R246.1
N$159: Q40.E R245.1
N$160: Q40.B R244.1 R246.2
N$161: Q39.B R239.1 R242.2
NOISE [NOISE]: R286.2 ; also sheet 2,8,12
R263: C69.1 IC37.7(B:OUT) R263.1 R269.1 R283.2
SD_OUT: IC40.7(B:OUT) J1.2 VR8.2(':S) VR8.3(':E)
TRIG_SD: R239.2 ; also sheet 1
Unconnected: VR6.M2 VR7.M2 VR8.M2 VR9.M2

### Notes on the sheet
- SnareDrum
- Q43, Q46 et Q49 ont été mis comme sur le schéma de la 909

## Sheet 4 of 15: LT
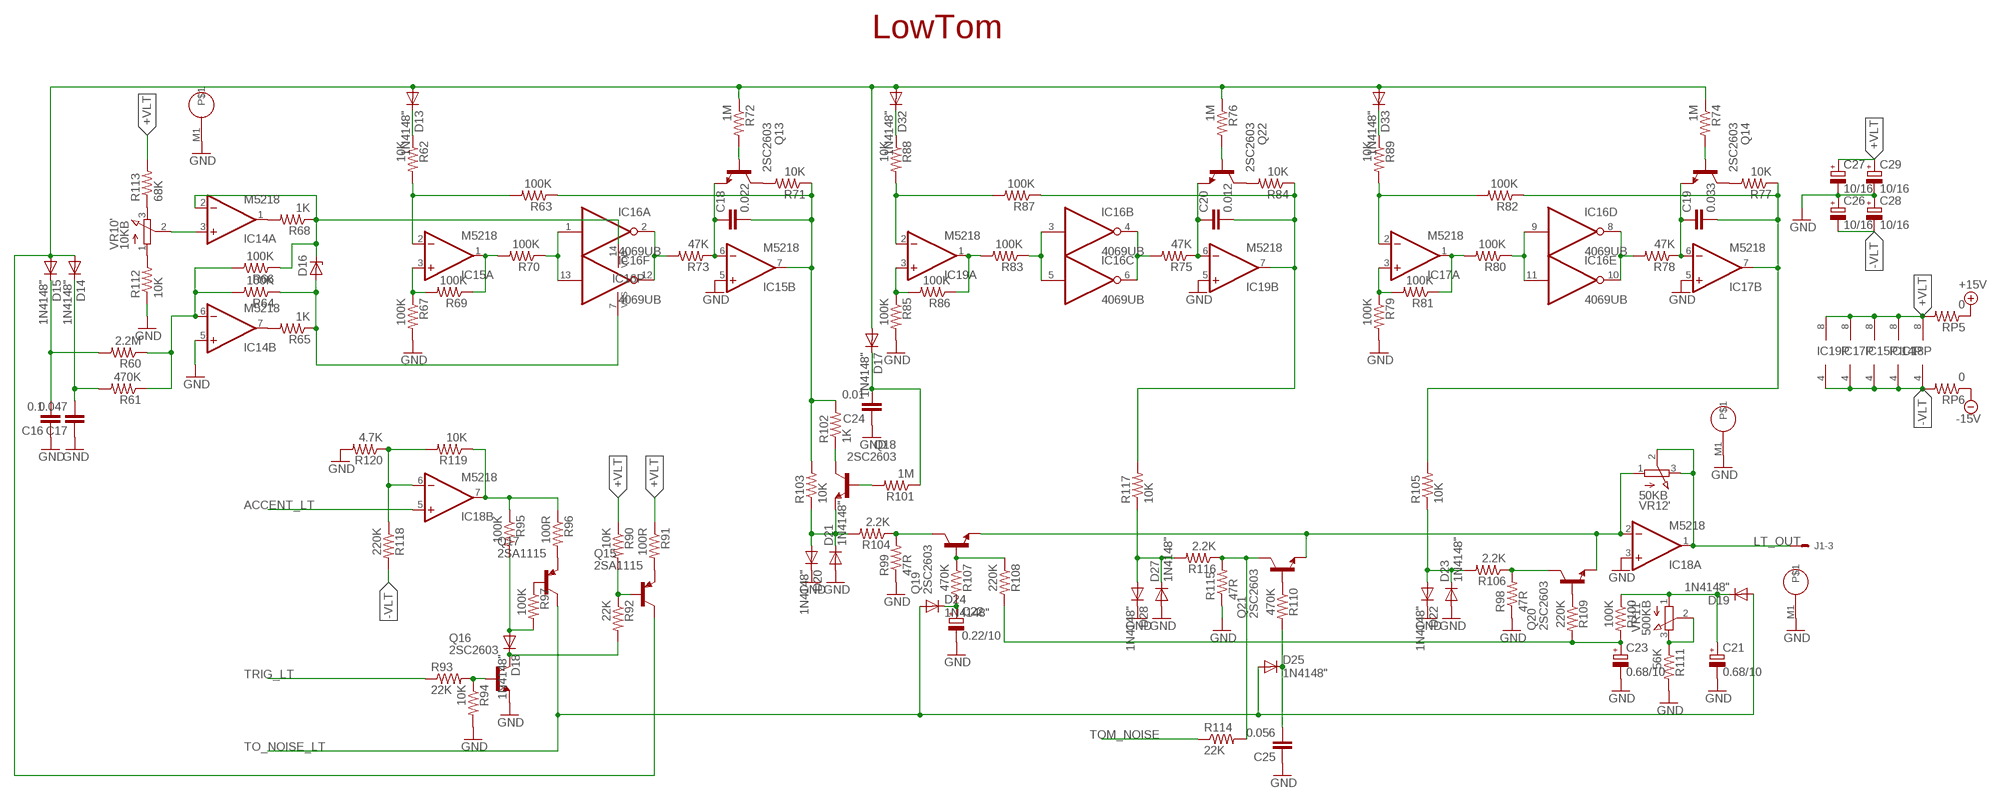
[diagram p3: schematic, sheet 4]

### Parts
C16  0.1  C-EU050-025X075  [C050-025X075]
C17  0.047  C-EU050-025X075  [C050-025X075]
C18  0.022  C-EU050-025X075  [C050-025X075]
C19  0.033  C-EU050-025X075  [C050-025X075]
C20  0.012  C-EU050-025X075  [C050-025X075]
C21  0.68/10  CPOL-EUE2-5  [E2-5]
C22  0.22/10  CPOL-EUE2-5  [E2-5]
C23  0.68/10  CPOL-EUE2-5  [E2-5]
C24  0.01  C-EU050-025X075  [C050-025X075]
C25  0.056  C-EU050-025X075  [C050-025X075]
C26  10/16  CPOL-EUE2-5  [E2-5]
C27  10/16  CPOL-EUE2-5  [E2-5]
C28  10/16  CPOL-EUE2-5  [E2-5]
C29  10/16  CPOL-EUE2-5  [E2-5]
D13  1N4148"  [DO35-7C]
D14  1N4148"  [DO35-7C]
D15  1N4148"  [DO35-7C]
D16  ZENER-DIODE  [DO41-7]
D17  1N4148"  [DO35-7C]
D18  1N4148"  [DO35-7C]
D19  1N4148"  [DO35-7C]
D20  1N4148"  [DO35-7C]
D21  1N4148"  [DO35-7C]
D22  1N4148"  [DO35-7C]
D23  1N4148"  [DO35-7C]
D24  1N4148"  [DO35-7C]
D25  1N4148"  [DO35-7C]
D27  1N4148"  [DO35-7C]
D28  1N4148"  [DO35-7C]
D32  1N4148"  [DO35-7C]
D33  1N4148"  [DO35-7C]
IC14  M5218  [SIL8]
IC15  M5218  [SIL8]
IC16  4069UB  4069N  [DIL14]
IC17  M5218  [SIL8]
IC18  M5218  [SIL8]
IC19  M5218  [SIL8]
Q13  2SC2603  [TO92-ECB]
Q14  2SC2603  [TO92-ECB]
Q15  2SA1115  [TO92-ECB-PNP]
Q16  2SC2603  [TO92-ECB]
Q17  2SA1115  [TO92-ECB-PNP]
Q18  2SC2603  [TO92-ECB]
Q19  2SC2603  [TO92-ECB]
Q20  2SC2603  [TO92-ECB]
Q21  2SC2603  [TO92-ECB]
Q22  2SC2603  [TO92-ECB]
R60  2.2M  R-US_0207/7  [0207/7]
R61  470K  R-US_0207/7  [0207/7]
R62  10K  R-US_0207/7  [0207/7]
R63  100K  R-US_0207/7  [0207/7]
R64  100K  R-US_0207/7  [0207/7]
R65  1K  R-US_0207/7  [0207/7]
R66  100K  R-US_0207/7  [0207/7]
R67  100K  R-US_0207/7  [0207/7]
R68  1K  R-US_0207/7  [0207/7]
R69  100K  R-US_0207/7  [0207/7]
R70  100K  R-US_0207/7  [0207/7]
R71  10K  R-US_0207/7  [0207/7]
R72  1M  R-US_0207/7  [0207/7]
R73  47K  R-US_0207/7  [0207/7]
R74  1M  R-US_0207/7  [0207/7]
R75  47K  R-US_0207/7  [0207/7]
R76  1M  R-US_0207/7  [0207/7]
R77  10K  R-US_0207/7  [0207/7]
R78  47K  R-US_0207/7  [0207/7]
R79  100K  R-US_0207/7  [0207/7]
R80  100K  R-US_0207/7  [0207/7]
R81  100K  R-US_0207/7  [0207/7]
R82  100K  R-US_0207/7  [0207/7]
R83  100K  R-US_0207/7  [0207/7]
R84  10K  R-US_0207/7  [0207/7]
R85  100K  R-US_0207/7  [0207/7]
R86  100K  R-US_0207/7  [0207/7]
R87  100K  R-US_0207/7  [0207/7]
R88  10K  R-US_0207/7  [0207/7]
R89  10K  R-US_0207/7  [0207/7]
R90  10K  R-US_0207/7  [0207/7]
R91  100R  R-US_0207/7  [0207/7]
R92  22K  R-US_0207/7  [0207/7]
R93  22K  R-US_0207/7  [0207/7]
R94  10K  R-US_0207/7  [0207/7]
R95  100K  R-US_0207/7  [0207/7]
R96  100R  R-US_0207/7  [0207/7]
R97  100K  R-US_0207/7  [0207/7]
R98  47R  R-US_0207/7  [0207/7]
R99  47R  R-US_0207/7  [0207/7]
R100  100K  R-US_0207/7  [0207/7]
R101  1M  R-US_0207/7  [0207/7]
R102  1K  R-US_0207/7  [0207/7]
R103  10K  R-US_0207/7  [0207/7]
R104  2.2K  R-US_0207/7  [0207/7]
R105  10K  R-US_0207/7  [0207/7]
R106  2.2K  R-US_0207/7  [0207/7]
R107  470K  R-US_0207/7  [0207/7]
R108  220K  R-US_0207/7  [0207/7]
R109  220K  R-US_0207/7  [0207/7]
R110  470K  R-US_0207/7  [0207/7]
R111  56K  R-US_0207/7  [0207/7]
R112  10K  R-US_0207/7  [0207/7]
R113  68K  R-US_0207/7  [0207/7]
R114  22K  R-US_0207/7  [0207/7]
R115  47R  R-US_0207/7  [0207/7]
R116  2.2K  R-US_0207/7  [0207/7]
R117  10K  R-US_0207/7  [0207/7]
R118  220K  R-US_0207/7  [0207/7]
R119  10K  R-US_0207/7  [0207/7]
R120  4.7K  R-US_0207/7  [0207/7]
RP5  0  R-US_0207/7  [0207/7]
RP6  0  R-US_0207/7  [0207/7]
VR10  10KB  EVUF3A  [EVUF]
VR11  500KB  EVUF3A  [EVUF]
VR12  50KB  EVUF3A  [EVUF]

### Nets
+15V: RP5.1 ; also sheet 1,2,3,6,7,8,9,11,12,13
+VLT: C27.+ C29.+ IC14.8(P:V+) IC15.8(P:V+) IC17.8(P:V+) IC18.8(P:V+) IC19.8(P:V+) R90.1 R91.1 R113.2 RP5.2
-15V: RP6.1 ; also sheet 1,2,3,6,7,8,9,11,12,13
-VLT [power]: C26.- C28.- IC14.4(P:V-) IC15.4(P:V-) IC17.4(P:V-) IC18.4(P:V-) IC19.4(P:V-) R118.2 RP6.2
ACCENT_LT: IC18.5(B:+IN) ; also sheet 1
GND: C16.1 C17.1 C21.- C22.- C23.- C24.1 C25.1 C26.+ C27.- C28.+ C29.- D20.C D21.A D22.C D23.A D27.A D28.C IC14.5(B:+IN) IC15.5(B:+IN) IC17.5(B:+IN) IC18.3(A:+IN) IC19.5(B:+IN) Q16.E R67.2 R79.2 R85.2 R94.2 R98.1 R99.1 R111.2 R112.1 R115.1 R120.2 VR10.M1 VR11.M1 VR12.M1 ; also sheet 1,2,3,5,6,7,8,9,10,11,12,13,14,15
LT_OUT: IC18.1(A:OUT) J1.3 VR12.2(':S) VR12.3(':E)
N$162: C18.1 IC15.6(B:-IN) Q13.E R73.1
N$165: Q13.C R71.2
N$167: IC14.1(A:OUT) R68.2
N$168: IC14.7(B:OUT) R65.2
N$169: IC14.6(B:-IN) R60.1 R61.1 R64.2 R66.2
N$170: D16.A IC16.7(P:VSS) R64.1 R65.1
N$171: D16.C IC14.2(A:-IN) IC16.14(P:VDD) R66.1 R68.1
N$172: R113.1 VR10.3(':E)
N$173: R112.2 VR10.1(':A)
N$174: IC14.3(A:+IN) VR10.2(':S)
N$175: IC15.3(A:+IN) R67.1 R69.2
N$176: IC15.2(A:-IN) R62.2 R63.2
N$177: IC15.1(A:OUT) R69.1 R70.2
N$178: IC16.1(A:I) IC16.13(F:I) R70.1
N$179: IC16.2(A:O) IC16.12(F:O) R73.2
N$180: Q13.B R72.2
N$181: C18.2 IC15.7(B:OUT) R63.1 R71.1 R102.2 R103.2
N$182: D13.C R62.1
N$183: C20.1 IC19.6(B:-IN) Q22.E R75.1
N$184: Q22.C R84.2
N$185: IC19.3(A:+IN) R85.1 R86.2
N$186: IC19.2(A:-IN) R87.2 R88.2
N$187: IC19.1(A:OUT) R83.2 R86.1
N$188: IC16.3(B:I) IC16.5(C:I) R83.1
N$189: IC16.4(B:O) IC16.6(C:O) R75.2
N$190: Q22.B R76.2
N$191: C20.2 IC19.7(B:OUT) R84.1 R87.1 R117.2
N$192: D32.C R88.1
N$193: C19.1 IC17.6(B:-IN) Q14.E R78.1
N$194: Q14.C R77.2
N$195: IC17.3(A:+IN) R79.1 R81.2
N$196: IC17.2(A:-IN) R82.2 R89.2
N$197: IC17.1(A:OUT) R80.2 R81.1
N$198: IC16.9(D:I) IC16.11(E:I) R80.1
N$199: IC16.8(D:O) IC16.10(E:O) R78.2
N$200: Q14.B R74.2
N$201: C19.2 IC17.7(B:OUT) R77.1 R82.1 R105.2
N$202: D33.C R89.1
N$203: C21.+ D19.C R100.1 VR11.1(':A)
N$204: C17.2 D14.C R61.2
N$205: C16.2 D15.C R60.2
N$206: D13.A D14.A D15.A D17.A D32.A D33.A Q15.C R72.1 R74.1 R76.1
N$207: Q19.B R107.1 R108.1
N$208: Q19.C R99.2 R104.1
N$209: D20.A D21.C Q18.E R103.1 R104.2
N$210: Q21.B R110.1
N$211: Q21.C R114.2 R115.2 R116.1
N$212: D27.C D28.A R116.2 R117.1
N$213: Q20.B R109.1
N$214: Q20.C R98.2 R106.1
N$215: D22.A D23.C R105.1 R106.2
N$216: Q18.C R102.1
N$217: C24.2 D17.C R101.1
N$218: Q18.B R101.2
N$219: R111.1 VR11.2(':S) VR11.3(':E)
N$220: IC18.2(A:-IN) Q19.E Q20.E Q21.E VR12.1(':A)
N$221: C23.+ R100.2 R108.2 R109.2
N$223: C25.2 D25.C R110.2
N$224: C22.+ D24.C R107.2
N$225: Q17.E R96.2
N$226: Q17.B R97.1
N$227: D18.C Q16.C R92.2
N$228: IC18.6(B:-IN) R118.1 R119.2 R120.1
N$229: IC18.7(B:OUT) R95.1 R96.1 R119.1
N$230: D18.A R95.2 R97.2
N$232: Q16.B R93.2 R94.1
N$234: Q15.E R91.2
N$235: Q15.B R90.2 R92.1
TO_NOISE_LT: D19.A D24.A D25.A Q17.C ; also sheet 12
TOM_NOISE: R114.1 ; also sheet 5,6,12
TRIG_LT: R93.1 ; also sheet 1,12
Unconnected: VR10.M2 VR11.M2 VR12.M2

### Notes on the sheet
- LowTom

## Sheet 5 of 15: MT
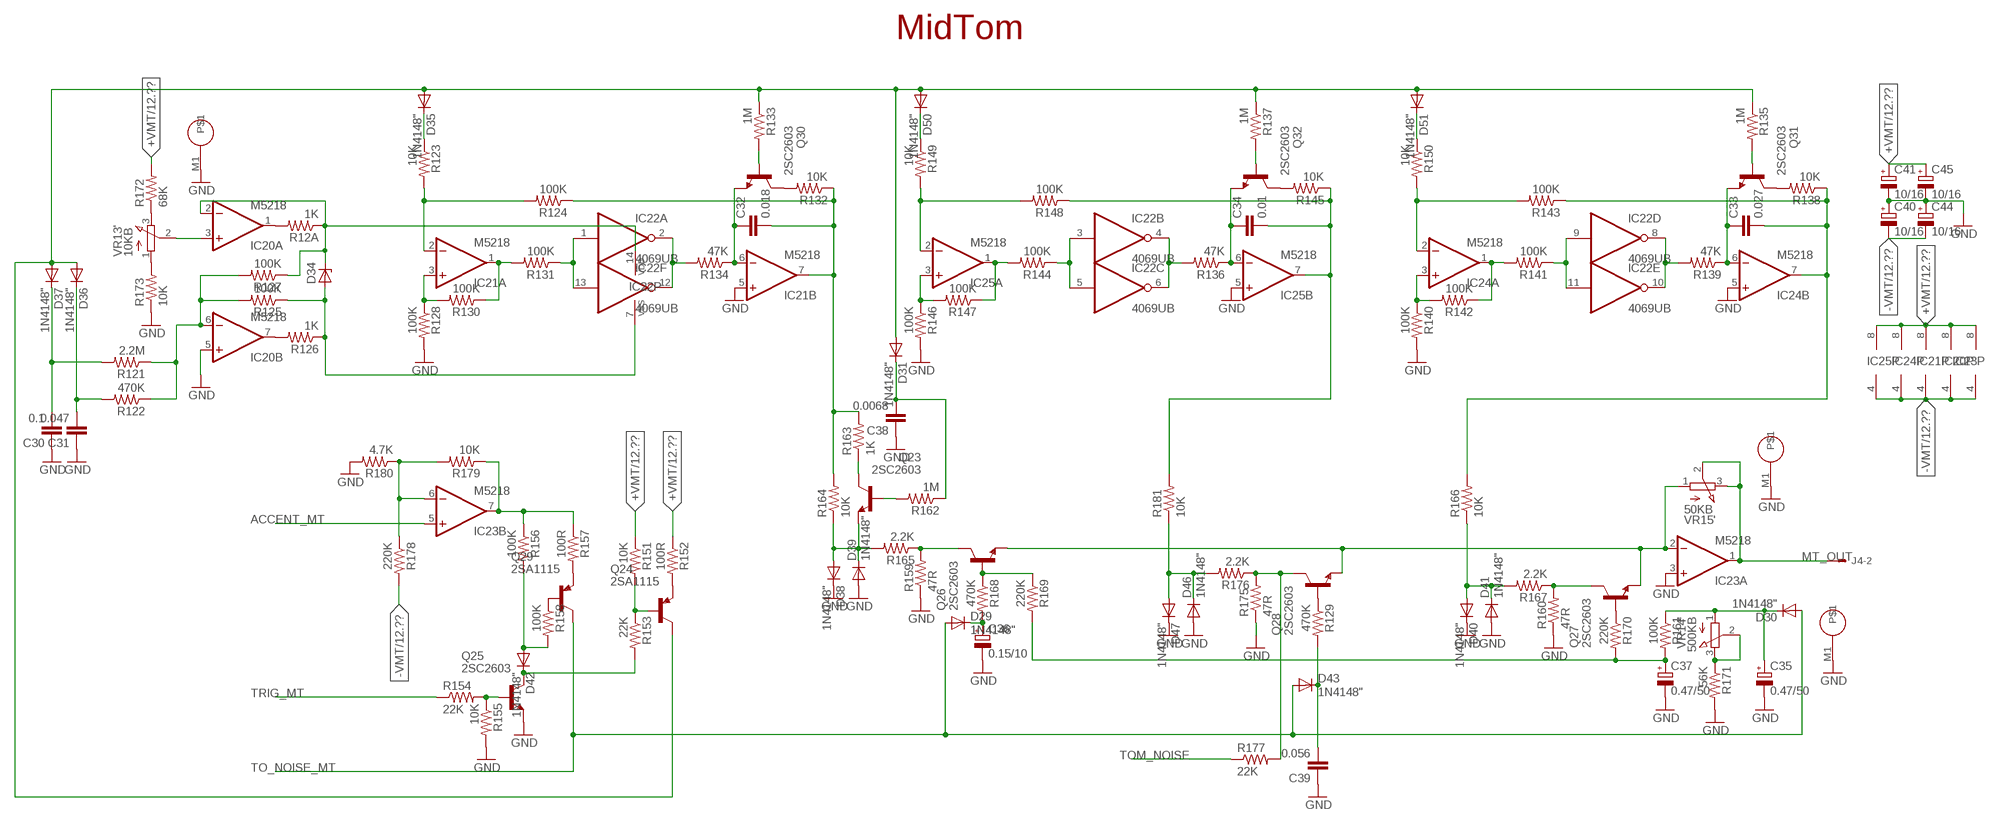
[diagram p4: schematic, sheet 5]

### Parts
C30  0.1  C-EU050-025X075  [C050-025X075]
C31  0.047  C-EU050-025X075  [C050-025X075]
C32  0.018  C-EU050-025X075  [C050-025X075]
C33  0.027  C-EU050-025X075  [C050-025X075]
C34  0.01  C-EU050-025X075  [C050-025X075]
C35  0.47/50  CPOL-EUE2-5  [E2-5]
C36  0.15/10  CPOL-EUE2-5  [E2-5]
C37  0.47/50  CPOL-EUE2-5  [E2-5]
C38  0.0068  C-EU050-025X075  [C050-025X075]
C39  0.056  C-EU050-025X075  [C050-025X075]
C40  10/16  CPOL-EUE2-5  [E2-5]
C41  10/16  CPOL-EUE2-5  [E2-5]
C44  10/16  CPOL-EUE2-5  [E2-5]
C45  10/16  CPOL-EUE2-5  [E2-5]
D29  1N4148"  [DO35-7C]
D30  1N4148"  [DO35-7C]
D31  1N4148"  [DO35-7C]
D34  ZENER-DIODE  [DO41-7]
D35  1N4148"  [DO35-7C]
D36  1N4148"  [DO35-7C]
D37  1N4148"  [DO35-7C]
D38  1N4148"  [DO35-7C]
D39  1N4148"  [DO35-7C]
D40  1N4148"  [DO35-7C]
D41  1N4148"  [DO35-7C]
D42  1N4148"  [DO35-7C]
D43  1N4148"  [DO35-7C]
D46  1N4148"  [DO35-7C]
D47  1N4148"  [DO35-7C]
D50  1N4148"  [DO35-7C]
D51  1N4148"  [DO35-7C]
IC20  M5218  [SIL8]
IC21  M5218  [SIL8]
IC22  4069UB  4069N  [DIL14]
IC23  M5218  [SIL8]
IC24  M5218  [SIL8]
IC25  M5218  [SIL8]
J4  22-27-2041-04  [6410-04]
Q23  2SC2603  [TO92-ECB]
Q24  2SA1115  [TO92-ECB-PNP]
Q25  2SC2603  [TO92-ECB]
Q26  2SC2603  [TO92-ECB]
Q27  2SC2603  [TO92-ECB]
Q28  2SC2603  [TO92-ECB]
Q29  2SA1115  [TO92-ECB-PNP]
Q30  2SC2603  [TO92-ECB]
Q31  2SC2603  [TO92-ECB]
Q32  2SC2603  [TO92-ECB]
R12A  1K  R-US_0207/7  [0207/7]
R121  2.2M  R-US_0207/7  [0207/7]
R122  470K  R-US_0207/7  [0207/7]
R123  10K  R-US_0207/7  [0207/7]
R124  100K  R-US_0207/7  [0207/7]
R125  100K  R-US_0207/7  [0207/7]
R126  1K  R-US_0207/7  [0207/7]
R127  100K  R-US_0207/7  [0207/7]
R128  100K  R-US_0207/7  [0207/7]
R129  470K  R-US_0207/7  [0207/7]
R130  100K  R-US_0207/7  [0207/7]
R131  100K  R-US_0207/7  [0207/7]
R132  10K  R-US_0207/7  [0207/7]
R133  1M  R-US_0207/7  [0207/7]
R134  47K  R-US_0207/7  [0207/7]
R135  1M  R-US_0207/7  [0207/7]
R136  47K  R-US_0207/7  [0207/7]
R137  1M  R-US_0207/7  [0207/7]
R138  10K  R-US_0207/7  [0207/7]
R139  47K  R-US_0207/7  [0207/7]
R140  100K  R-US_0207/7  [0207/7]
R141  100K  R-US_0207/7  [0207/7]
R142  100K  R-US_0207/7  [0207/7]
R143  100K  R-US_0207/7  [0207/7]
R144  100K  R-US_0207/7  [0207/7]
R145  10K  R-US_0207/7  [0207/7]
R146  100K  R-US_0207/7  [0207/7]
R147  100K  R-US_0207/7  [0207/7]
R148  100K  R-US_0207/7  [0207/7]
R149  10K  R-US_0207/7  [0207/7]
R150  10K  R-US_0207/7  [0207/7]
R151  10K  R-US_0207/7  [0207/7]
R152  100R  R-US_0207/7  [0207/7]
R153  22K  R-US_0207/7  [0207/7]
R154  22K  R-US_0207/7  [0207/7]
R155  10K  R-US_0207/7  [0207/7]
R156  100K  R-US_0207/7  [0207/7]
R157  100R  R-US_0207/7  [0207/7]
R158  100K  R-US_0207/7  [0207/7]
R159  47R  R-US_0207/7  [0207/7]
R160  47R  R-US_0207/7  [0207/7]
R161  100K  R-US_0207/7  [0207/7]
R162  1M  R-US_0207/7  [0207/7]
R163  1K  R-US_0207/7  [0207/7]
R164  10K  R-US_0207/7  [0207/7]
R165  2.2K  R-US_0207/7  [0207/7]
R166  10K  R-US_0207/7  [0207/7]
R167  2.2K  R-US_0207/7  [0207/7]
R168  470K  R-US_0207/7  [0207/7]
R169  220K  R-US_0207/7  [0207/7]
R170  220K  R-US_0207/7  [0207/7]
R171  56K  R-US_0207/7  [0207/7]
R172  68K  R-US_0207/7  [0207/7]
R173  10K  R-US_0207/7  [0207/7]
R175  47R  R-US_0207/7  [0207/7]
R176  2.2K  R-US_0207/7  [0207/7]
R177  22K  R-US_0207/7  [0207/7]
R178  220K  R-US_0207/7  [0207/7]
R179  10K  R-US_0207/7  [0207/7]
R180  4.7K  R-US_0207/7  [0207/7]
R181  10K  R-US_0207/7  [0207/7]
VR13  10KB  EVUF3A  [EVUF]
VR14  500KB  EVUF3A  [EVUF]
VR15  50KB  EVUF3A  [EVUF]

### Nets
+VMT [power]: C41.+ C45.+ IC20.8(P:V+) IC21.8(P:V+) IC23.8(P:V+) IC24.8(P:V+) IC25.8(P:V+) R151.1 R152.1 R172.2 ; also sheet 12
-VMT [power]: C40.- C44.- IC20.4(P:V-) IC21.4(P:V-) IC23.4(P:V-) IC24.4(P:V-) IC25.4(P:V-) R178.2 ; also sheet 12
ACCENT_MT: IC23.5(B:+IN) ; also sheet 1
GND: C30.1 C31.1 C35.- C36.- C37.- C38.1 C39.1 C40.+ C41.- C44.+ C45.- D38.C D39.A D40.C D41.A D46.A D47.C IC20.5(B:+IN) IC21.5(B:+IN) IC23.3(A:+IN) IC24.5(B:+IN) IC25.5(B:+IN) Q25.E R128.2 R140.2 R146.2 R155.2 R159.1 R160.1 R171.2 R173.1 R175.1 R180.2 VR13.M1 VR14.M1 VR15.M1 ; also sheet 1,2,3,4,6,7,8,9,10,11,12,13,14,15
MT_OUT: IC23.1(A:OUT) J4.2 VR15.2(':S) VR15.3(':E)
N$301: C32.1 IC21.6(B:-IN) Q30.E R134.1
N$302: Q30.C R132.2
N$303: IC20.1(A:OUT) R12A.2
N$304: IC20.7(B:OUT) R126.2
N$305: IC20.6(B:-IN) R121.1 R122.1 R125.2 R127.2
N$306: D34.A IC22.7(P:VSS) R125.1 R126.1
N$307: D34.C IC20.2(A:-IN) IC22.14(P:VDD) R12A.1 R127.1
N$308: R172.1 VR13.3(':E)
N$309: R173.2 VR13.1(':A)
N$310: IC20.3(A:+IN) VR13.2(':S)
N$311: IC21.3(A:+IN) R128.1 R130.2
N$312: IC21.2(A:-IN) R123.2 R124.2
N$313: IC21.1(A:OUT) R130.1 R131.2
N$314: IC22.1(A:I) IC22.13(F:I) R131.1
N$315: IC22.2(A:O) IC22.12(F:O) R134.2
N$316: Q30.B R133.2
N$317: C32.2 IC21.7(B:OUT) R124.1 R132.1 R163.2 R164.2
N$318: D35.C R123.1
N$319: C34.1 IC25.6(B:-IN) Q32.E R136.1
N$320: Q32.C R145.2
N$321: IC25.3(A:+IN) R146.1 R147.2
N$322: IC25.2(A:-IN) R148.2 R149.2
N$323: IC25.1(A:OUT) R144.2 R147.1
N$324: IC22.3(B:I) IC22.5(C:I) R144.1
N$325: IC22.4(B:O) IC22.6(C:O) R136.2
N$326: Q32.B R137.2
N$327: C34.2 IC25.7(B:OUT) R145.1 R148.1 R181.2
N$328: D50.C R149.1
N$329: C33.1 IC24.6(B:-IN) Q31.E R139.1
N$330: Q31.C R138.2
N$331: IC24.3(A:+IN) R140.1 R142.2
N$332: IC24.2(A:-IN) R143.2 R150.2
N$333: IC24.1(A:OUT) R141.2 R142.1
N$334: IC22.9(D:I) IC22.11(E:I) R141.1
N$335: IC22.8(D:O) IC22.10(E:O) R139.2
N$336: Q31.B R135.2
N$337: C33.2 IC24.7(B:OUT) R138.1 R143.1 R166.2
N$338: D51.C R150.1
N$339: C31.2 D36.C R122.2
N$340: C30.2 D37.C R121.2
N$341: D31.A D35.A D36.A D37.A D50.A D51.A Q24.C R133.1 R135.1 R137.1
N$342: Q26.B R168.1 R169.1
N$343: Q26.C R159.2 R165.1
N$344: D38.A D39.C Q23.E R164.1 R165.2
N$345: Q28.B R129.1
N$346: Q28.C R175.2 R176.1 R177.2
N$347: D46.C D47.A R176.2 R181.1
N$348: Q27.B R170.1
N$349: Q27.C R160.2 R167.1
N$350: D40.A D41.C R166.1 R167.2
N$351: Q23.C R163.1
N$352: C38.2 D31.C R162.1
N$353: Q23.B R162.2
N$354: IC23.2(A:-IN) Q26.E Q27.E Q28.E VR15.1(':A)
N$355: C35.+ D30.C R161.1 VR14.1(':A)
N$356: R171.1 VR14.2(':S) VR14.3(':E)
N$357: C37.+ R161.2 R169.2 R170.2
N$358: C39.2 D43.C R129.2
N$359: C36.+ D29.C R168.2
N$360: Q29.E R157.2
N$361: Q29.B R158.1
N$362: D42.C Q25.C R153.2
N$363: IC23.6(B:-IN) R178.1 R179.2 R180.1
N$364: IC23.7(B:OUT) R156.1 R157.1 R179.1
N$365: D42.A R156.2 R158.2
N$366: Q25.B R154.2 R155.1
N$367: Q24.E R152.2
N$368: Q24.B R151.2 R153.1
TO_NOISE_MT: D29.A D30.A D43.A Q29.C ; also sheet 12
TOM_NOISE: R177.1 ; also sheet 4,6,12
TRIG_MT: R154.1 ; also sheet 1,12
Unconnected: VR13.M2 VR14.M2 VR15.M2

### Notes on the sheet
- MidTom